# Altium project Jetson AGX Xavier Carrier Board.PrjPcb (part 3 of 8)

## Sheet M.2 E-KEY.SchDoc: M.2 E-Key Connector
size 431 x 279 mm; CheckedBy: Lance Bantoto; Engineer: Cindy Li; DocumentNumber: 18; Revision: 1; SheetNumber: 18; SheetTotal: 23
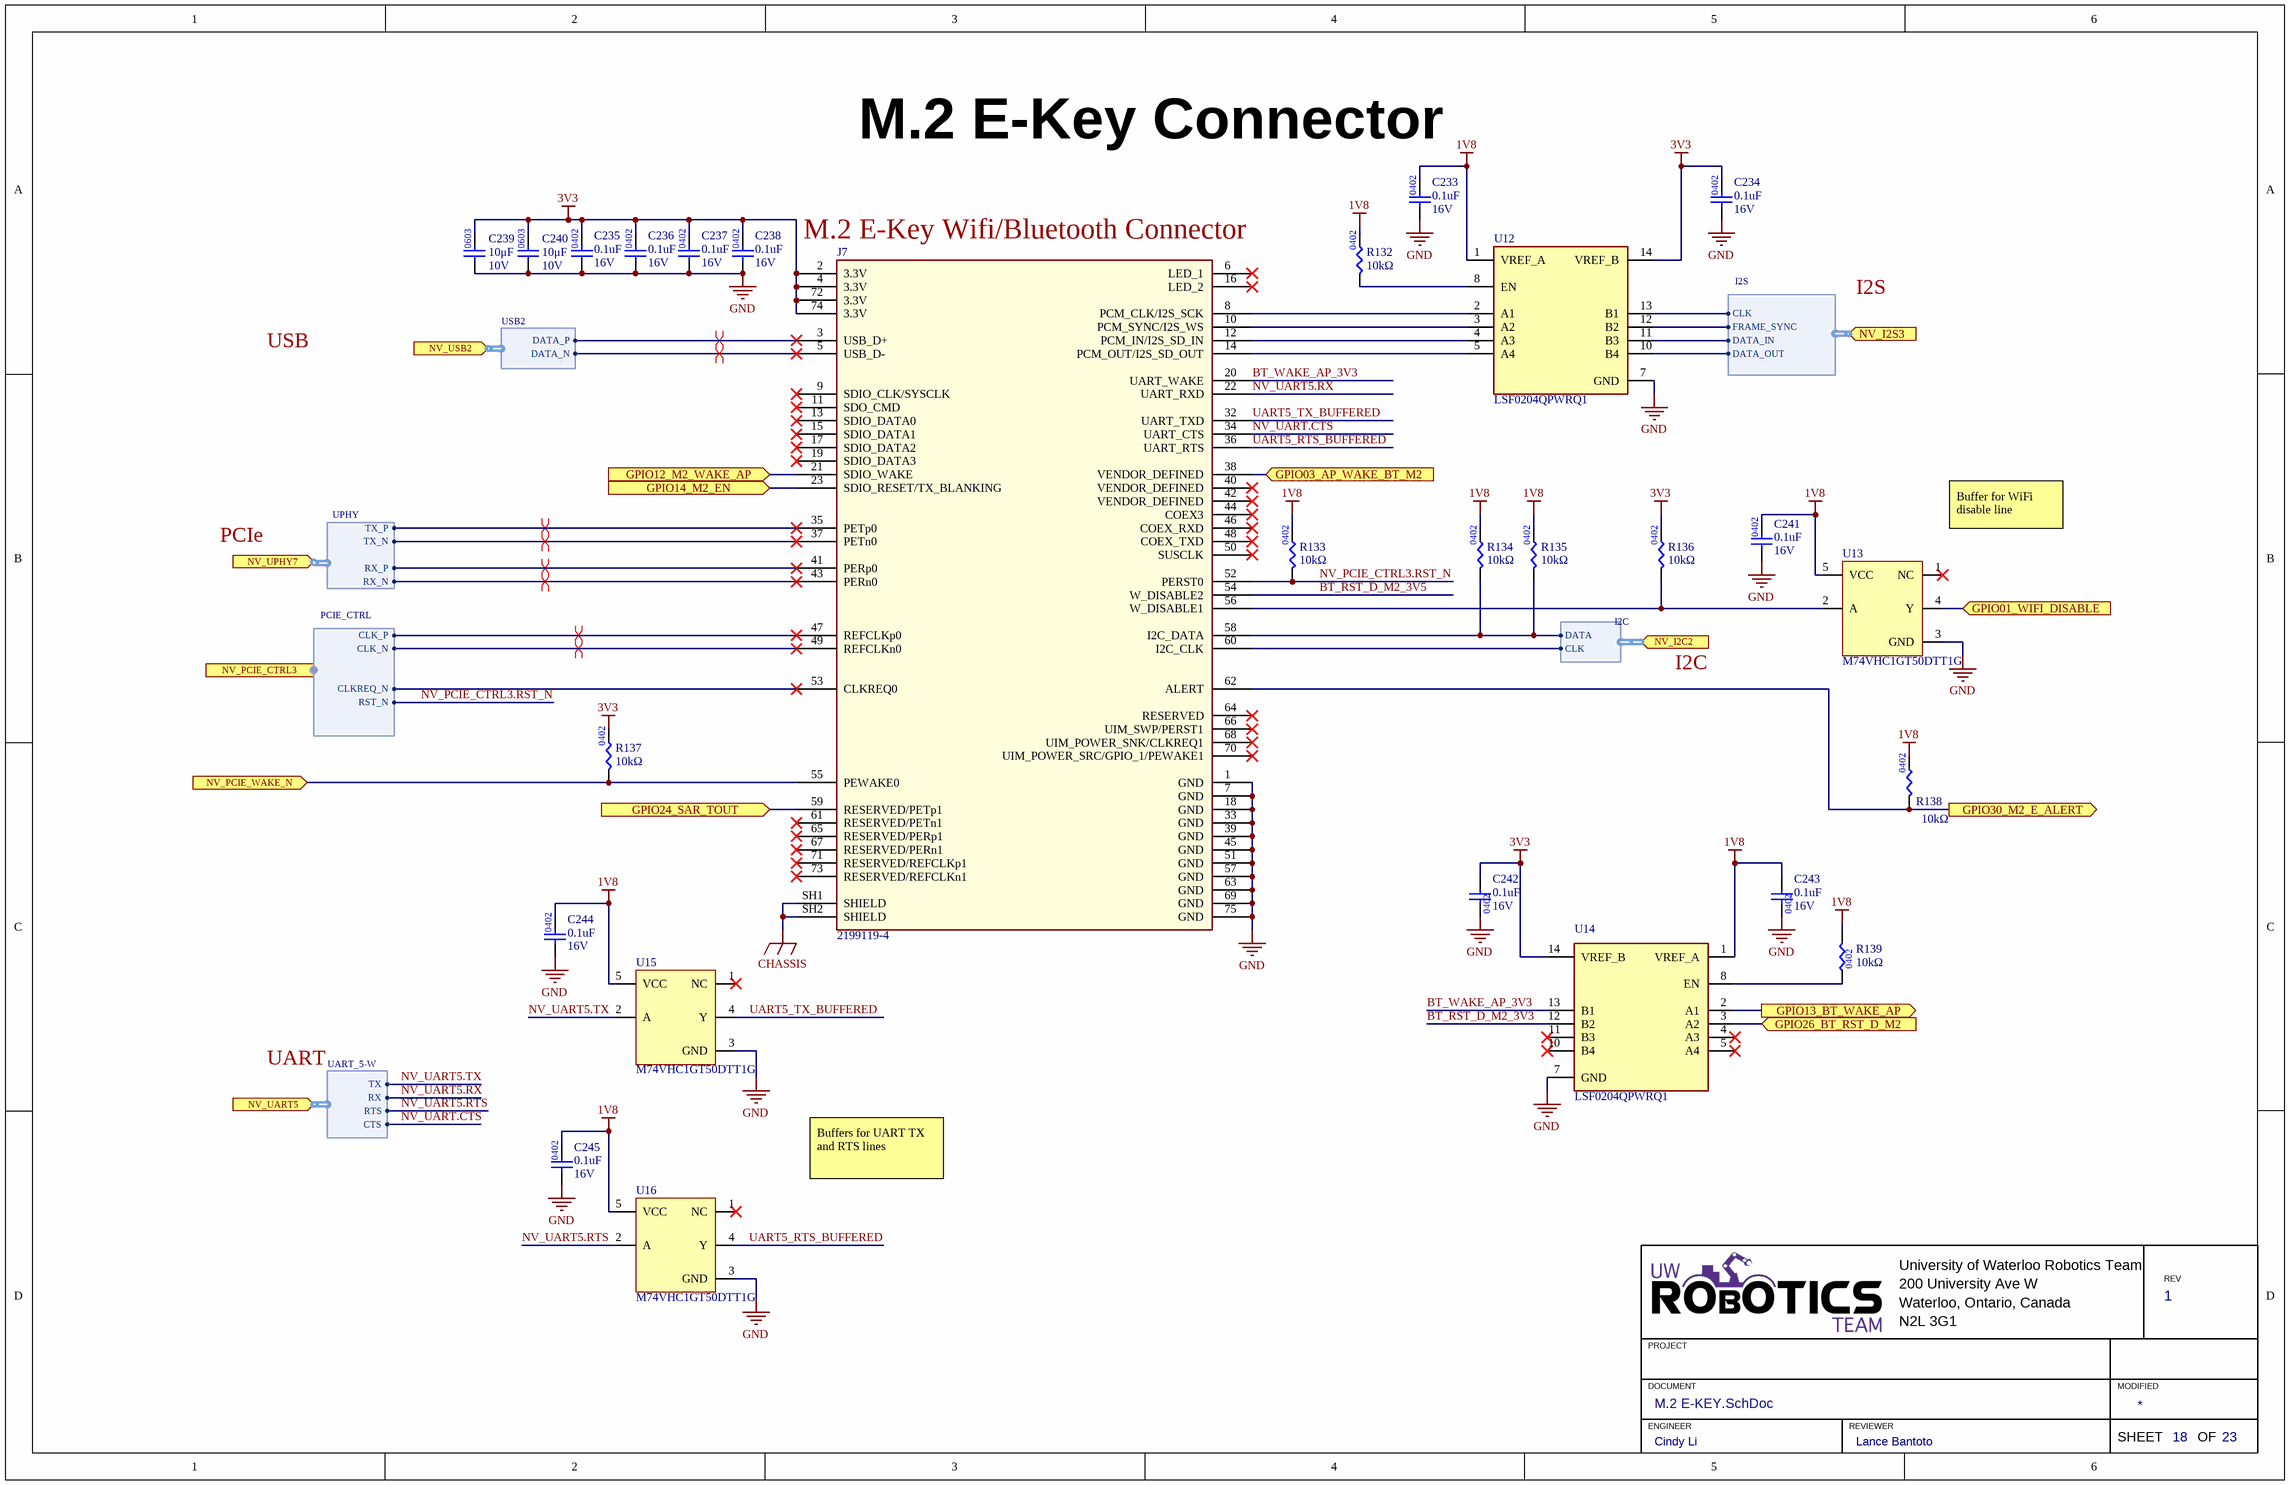
[diagram p6: M.2 E-KEY.SchDoc]

### Parts
C233  Capacitance: 0.1uF  Voltage Rating: 16V  [CAP0402]  (hidden comment: CAP_0.1uF_16V_X7R_0402)
C234  Capacitance: 0.1uF  Voltage Rating: 16V  [CAP0402]  (hidden comment: CAP_0.1uF_16V_X7R_0402)
C235  Capacitance: 0.1uF  Voltage Rating: 16V  [CAP0402]  (hidden comment: CAP_0.1uF_16V_X7R_0402)
C236  Capacitance: 0.1uF  Voltage Rating: 16V  [CAP0402]  (hidden comment: CAP_0.1uF_16V_X7R_0402)
C237  Capacitance: 0.1uF  Voltage Rating: 16V  [CAP0402]  (hidden comment: CAP_0.1uF_16V_X7R_0402)
C238  Capacitance: 0.1uF  Voltage Rating: 16V  [CAP0402]  (hidden comment: CAP_0.1uF_16V_X7R_0402)
C239  value 10μF  Voltage Rating: 10V  [CAP0603]  (hidden comment: CAP_10uF_10V_0603)
C240  value 10μF  Voltage Rating: 10V  [CAP0603]  (hidden comment: CAP_10uF_10V_0603)
C241  Capacitance: 0.1uF  Voltage Rating: 16V  [CAP0402]  (hidden comment: CAP_0.1uF_16V_X7R_0402)
C242  Capacitance: 0.1uF  Voltage Rating: 16V  [CAP0402]  (hidden comment: CAP_0.1uF_16V_X7R_0402)
C243  Capacitance: 0.1uF  Voltage Rating: 16V  [CAP0402]  (hidden comment: CAP_0.1uF_16V_X7R_0402)
C244  Capacitance: 0.1uF  Voltage Rating: 16V  [CAP0402]  (hidden comment: CAP_0.1uF_16V_X7R_0402)
C245  Capacitance: 0.1uF  Voltage Rating: 16V  [CAP0402]  (hidden comment: CAP_0.1uF_16V_X7R_0402)
J7  2199119-4  [TE_2199119-4]
R132  Resistance: 10kΩ  [RES0402]  (hidden comment: RES_10kΩ_0402_1%)
R133  Resistance: 10kΩ  [RES0402]  (hidden comment: RES_10kΩ_0402_1%)
R134  Resistance: 10kΩ  [RES0402]  (hidden comment: RES_10kΩ_0402_1%)
R135  Resistance: 10kΩ  [RES0402]  (hidden comment: RES_10kΩ_0402_1%)
R136  Resistance: 10kΩ  [RES0402]  (hidden comment: RES_10kΩ_0402_1%)
R137  Resistance: 10kΩ  [RES0402]  (hidden comment: RES_10kΩ_0402_1%)
R138  Resistance: 10kΩ  [RES0402]  (hidden comment: RES_10kΩ_0402_1%)
R139  Resistance: 10kΩ  [RES0402]  (hidden comment: RES_10kΩ_0402_1%)
U12  LSF0204QPWRQ1  [14-TSSOP]
U13  Manufacturer Part Number 1: M74VHC1GT50DTT1G  [SOT23-5]  (hidden comment: IC_BUFFER)
U14  LSF0204QPWRQ1  [14-TSSOP]
U15  Manufacturer Part Number 1: M74VHC1GT50DTT1G  [SOT23-5]  (hidden comment: IC_BUFFER)
U16  Manufacturer Part Number 1: M74VHC1GT50DTT1G  [SOT23-5]  (hidden comment: IC_BUFFER)

### Ports
GPIO01_WIFI_DISABLE (in), GPIO03_AP_WAKE_BT_M2 (in), GPIO12_M2_WAKE_AP (in), GPIO13_BT_WAKE_AP (out), GPIO14_M2_EN (in), GPIO24_SAR_TOUT (in), GPIO26_BT_RST_D_M2 (in), GPIO30_M2_E_ALERT (out), NV_I2C2 (in, harness I2C), NV_I2S3 (in, harness I2S), NV_PCIE_CTRL3 (in, harness PCIE_CTRL), NV_PCIE_WAKE_N (in), NV_UART5 (in, harness UART_5-W), NV_UPHY7 (in, harness UPHY), NV_USB2 (in, harness USB2)

### Harnesses
UPHY: TX_P, TX_N, RX_P, RX_N
PCIE_CTRL: CLK_P, CLK_N, RST_N, CLKREQ_N
I2C: CLK, DATA
I2S: CLK, FRAME_SYNC, DATA_IN, DATA_OUT
UART_5-W: TX, RX, RTS, CTS
USB2: DATA_P, DATA_N

### Nets
1V8: C233.2 C241.2 C243.2 C244.2 C245.2 R132.2 R133.2 R134.2 R135.2 R138.2 R139.2 U12.1(VREF_A) U13.5(VCC) U14.1(VREF_A) U15.5(VCC) U16.5(VCC)
3V3: C234.2 C235.2 C236.2 C237.2 C238.2 C239.2 C240.2 C242.2 J7.2(3.3V) J7.4(3.3V) J7.72(3.3V) J7.74(3.3V) R136.2 R137.2 U12.14(VREF_B) U14.14(VREF_B)
CHASSIS: J7.SH1(SHIELD) J7.SH2(SHIELD)
GND: C233.1 C234.1 C235.1 C236.1 C237.1 C238.1 C239.1 C240.1 C241.1 C242.1 C243.1 C244.1 C245.1 J7.1(GND) J7.7(GND) J7.18(GND) J7.33(GND) J7.39(GND) J7.45(GND) J7.51(GND) J7.57(GND) J7.63(GND) J7.69(GND) J7.75(GND) U12.7(GND) U13.3(GND) U14.7(GND) U15.3(GND) U16.3(GND)
BT_RST_D_M2_3V3: U14.12(B2)
BT_RST_D_M2_3V5: J7.54(W_DISABLE2)
BT_WAKE_AP_3V3: J7.20(UART_WAKE) U14.13(B1)
NV_I2C2.CLK: J7.60(I2C_CLK) ; port NV_I2C2.CLK
NV_I2C2.DATA: J7.58(I2C_DATA) R134.1 R135.1 ; port NV_I2C2.DATA
NV_PCIE_CTRL3.CLK_N: J7.49(REFCLKn0) ; port NV_PCIE_CTRL3.CLK_N
NV_PCIE_CTRL3.CLK_P: J7.47(REFCLKp0) ; port NV_PCIE_CTRL3.CLK_P
NV_PCIE_CTRL3.CLKREQ_N: J7.53(CLKREQ0) ; port NV_PCIE_CTRL3.CLKREQ_N
NV_PCIE_CTRL3.RST_N: J7.52(PERST0) R133.1 ; port NV_PCIE_CTRL3.RST_N
NV_PCIE_WAKE_N: J7.55(PEWAKE0) R137.1 ; port NV_PCIE_WAKE_N
NV_UART5.RTS: U16.2(A) ; port NV_UART5.RTS
NV_UART5.RX: J7.22(UART_RXD) ; port NV_UART5.RX
NV_UART5.TX: U15.2(A) ; port NV_UART5.TX
NV_UART.CTS: J7.34(UART_CTS) ; port NV_UART5.CTS
NV_UPHY7.RX_N: J7.43(PERn0) ; port NV_UPHY7.RX_N
NV_UPHY7.RX_P: J7.41(PERp0) ; port NV_UPHY7.RX_P
NV_UPHY7.TX_N: J7.37(PETn0) ; port NV_UPHY7.TX_N
NV_UPHY7.TX_P: J7.35(PETp0) ; port NV_UPHY7.TX_P
NV_USB2.DATA_N: J7.5(USB_D-) ; port NV_USB2.DATA_N
NV_USB2.DATA_P: J7.3(USB_D+) ; port NV_USB2.DATA_P
UART5_RTS_BUFFERED: J7.36(UART_RTS) U16.4(Y)
UART5_TX_BUFFERED: J7.32(UART_TXD) U15.4(Y)
NetJ7_8: J7.8(PCM_CLK/I2S_SCK) U12.2(A1)
NetJ7_10: J7.10(PCM_SYNC/I2S_WS) U12.3(A2)
NetJ7_12: J7.12(PCM_IN/I2S_SD_IN) U12.4(A3)
NetJ7_14: J7.14(PCM_OUT/I2S_SD_OUT) U12.5(A4)
NetJ7_21: J7.21(SDIO_WAKE) ; port GPIO12_M2_WAKE_AP
NetJ7_23: J7.23(SDIO_RESET/TX_BLANKING) ; port GPIO14_M2_EN
NetJ7_38: J7.38(VENDOR_DEFINED) ; port GPIO03_AP_WAKE_BT_M2
NetJ7_56: J7.56(W_DISABLE1) R136.1 U13.2(A)
NetJ7_59: J7.59(RESERVED/PETp1) ; port GPIO24_SAR_TOUT
NetJ7_62: J7.62(ALERT) R138.1 ; port GPIO30_M2_E_ALERT
NetR132_1: R132.1 U12.8(EN)
NetR139_1: R139.1 U14.8(EN)
NetU12_10: U12.10(B4) ; port NV_I2S3.DATA_OUT
NetU12_11: U12.11(B3) ; port NV_I2S3.DATA_IN
NetU12_12: U12.12(B2) ; port NV_I2S3.FRAME_SYNC
NetU12_13: U12.13(B1) ; port NV_I2S3.CLK
NetU13_4: U13.4(Y) ; port GPIO01_WIFI_DISABLE
NetU14_2: U14.2(A1) ; port GPIO13_BT_WAKE_AP
NetU14_3: U14.3(A2) ; port GPIO26_BT_RST_D_M2

Not connected (* = marked no-connect by the designer): J7 6(LED_1)* 9(SDIO_CLK/SYSCLK)* 11(SDO_CMD)* 13(SDIO_DATA0)* 15(SDIO_DATA1)* 16(LED_2)* 17(SDIO_DATA2)* 19(SDIO_DATA3)* 40(VENDOR_DEFINED)* 42(VENDOR_DEFINED)* 44(COEX3)* 46(COEX_RXD)* 48(COEX_TXD)* 50(SUSCLK)* 61(RESERVED/PETn1)* 64(RESERVED)* 65(RESERVED/PERp1)* 66(UIM_SWP/PERST1)* 67(RESERVED/PERn1)* 68(UIM_POWER_SNK/CLKREQ1)* 70(UIM_POWER_SRC/GPIO_1/PEWAKE1)* 71(RESERVED/REFCLKp1)* 73(RESERVED/REFCLKn1)*; U13 1(NC)*; U14 4(A3)* 5(A4)* 10(B4)* 11(B3)*; U15 1(NC)*; U16 1(NC)*

### Layout directives
differential pair: NV_PCIE_CTRL3.CLK_N, NV_PCIE_CTRL3.CLK_P, NV_UPHY7.RX_N, NV_UPHY7.RX_P, NV_UPHY7.TX_N, NV_UPHY7.TX_P, NV_USB2.DATA_N, NV_USB2.DATA_P

### Notes on the sheet
- (near J7) M.2 E-Key Wifi/Bluetooth Connector
- I2S
- USB
- PCIe
- Buffer for WiFi disable line
- I2C
- UART
- Buffers for UART TX and RTS lines
- University of Waterloo Robotics Team
- 200 University Ave W
- REV
- PROJECT
- Waterloo, Ontario, Canada
- N2L 3G1
- DOCUMENT
- ENGINEER
- REVIEWER
- MODIFIED
- SHEET
- OF
- (in symbol CAP_10uF_10V_0603) 0603

### Library data of the parts
C233-C238 C241-C245 = CAP_0.1uF_16V_X7R_0402: CAP CER 0.1UF 16V X7R 0402; Supplier 1: Digi-Key; Mounting Type: Surface Mount; Package: 0402
C239 C240 = CAP_10uF_10V_0603: CAP CER 10UF 10V X5R 0603; Manufacturer 1: Yageo; Manufacturer Part Number 1: CC0603MRX5R6BB106; Supplier Part Number 1: 311-1817-1-ND; Supplier 1: Digi-Key; Dielectric: X5R
J7 = 2199119-4: CONN M.2 FEMALE 67POS 0.020 GOLD; Manufacturer 1: TE Connectivity; Number of Positions: 67; Pitch: 0.020" (0.50mm); Supplier 1: Digi-Key; Supplier Part Number 1: A115900CT-ND; Gender: Female; Manufacturer Part Number 1: 2199119-4
R132 R133 R137-R139 = RES_10kΩ_0402_1%: RES 10K OHM 1% 1/16W 0402; Manufacturer Part Number 1: RC1005F103CS; Manufacturer 1: Samsung Electro-Mechanics; Supplier 1: Digi-Key; Supplier Part Number 1: 1276-3431-1-ND; Tolerance: 1%; Package: 0402
R134-R136 = RES_10kΩ_0402_1%: RES 10K OHM 1% 1/16W 0402; Manufacturer 1: Samsung Electro-Mechanics; Manufacturer Part Number 1: RC1005F103CS; Supplier Part Number 1: 1276-3431-1-ND; Supplier 1: Digi-Key; Tolerance: 1%; Package: 0402
U12 U14 = LSF0204QPWRQ1: 4-BITS MULTI-VOLTAGE LEVEL TRANS; Manufacturer 1: Texas Instruments; Channel Type: Bidirectional; Channels per Circuit: 4; Output Type: Open Drain, Push Pull; Data Rate: 100MBd; Voltage - VCCA: 0.8V - 4.5V; Voltage - VCCB: 1.8V - 5.5V; Manufacturer Part Number 1: LSF0204QPWRQ1; Supplier 1: Digi-Key; Supplier Part Number 1: 296-51425-1-ND; Package: 14-TSSOP
U13 U15 U16 = IC_BUFFER: IC BUFFER NON-INVERT 5.5V 5TSOP; Manufacturer 1: onsemi; Package/Footprint: TSOP-5; Supplier 1: Digi-Key; Mounting Type: SMD; Supplier Part Number 1: M74VHC1GT50DTT1GOSCT-ND

## Sheet M.2 M-KEY.SchDoc: M.2 M-KEY Connector
size 431 x 279 mm; CheckedBy: Lance Bantoto; Engineer: Chealsie Bains; DocumentNumber: 19; Revision: 1; SheetNumber: 19; SheetTotal: 23
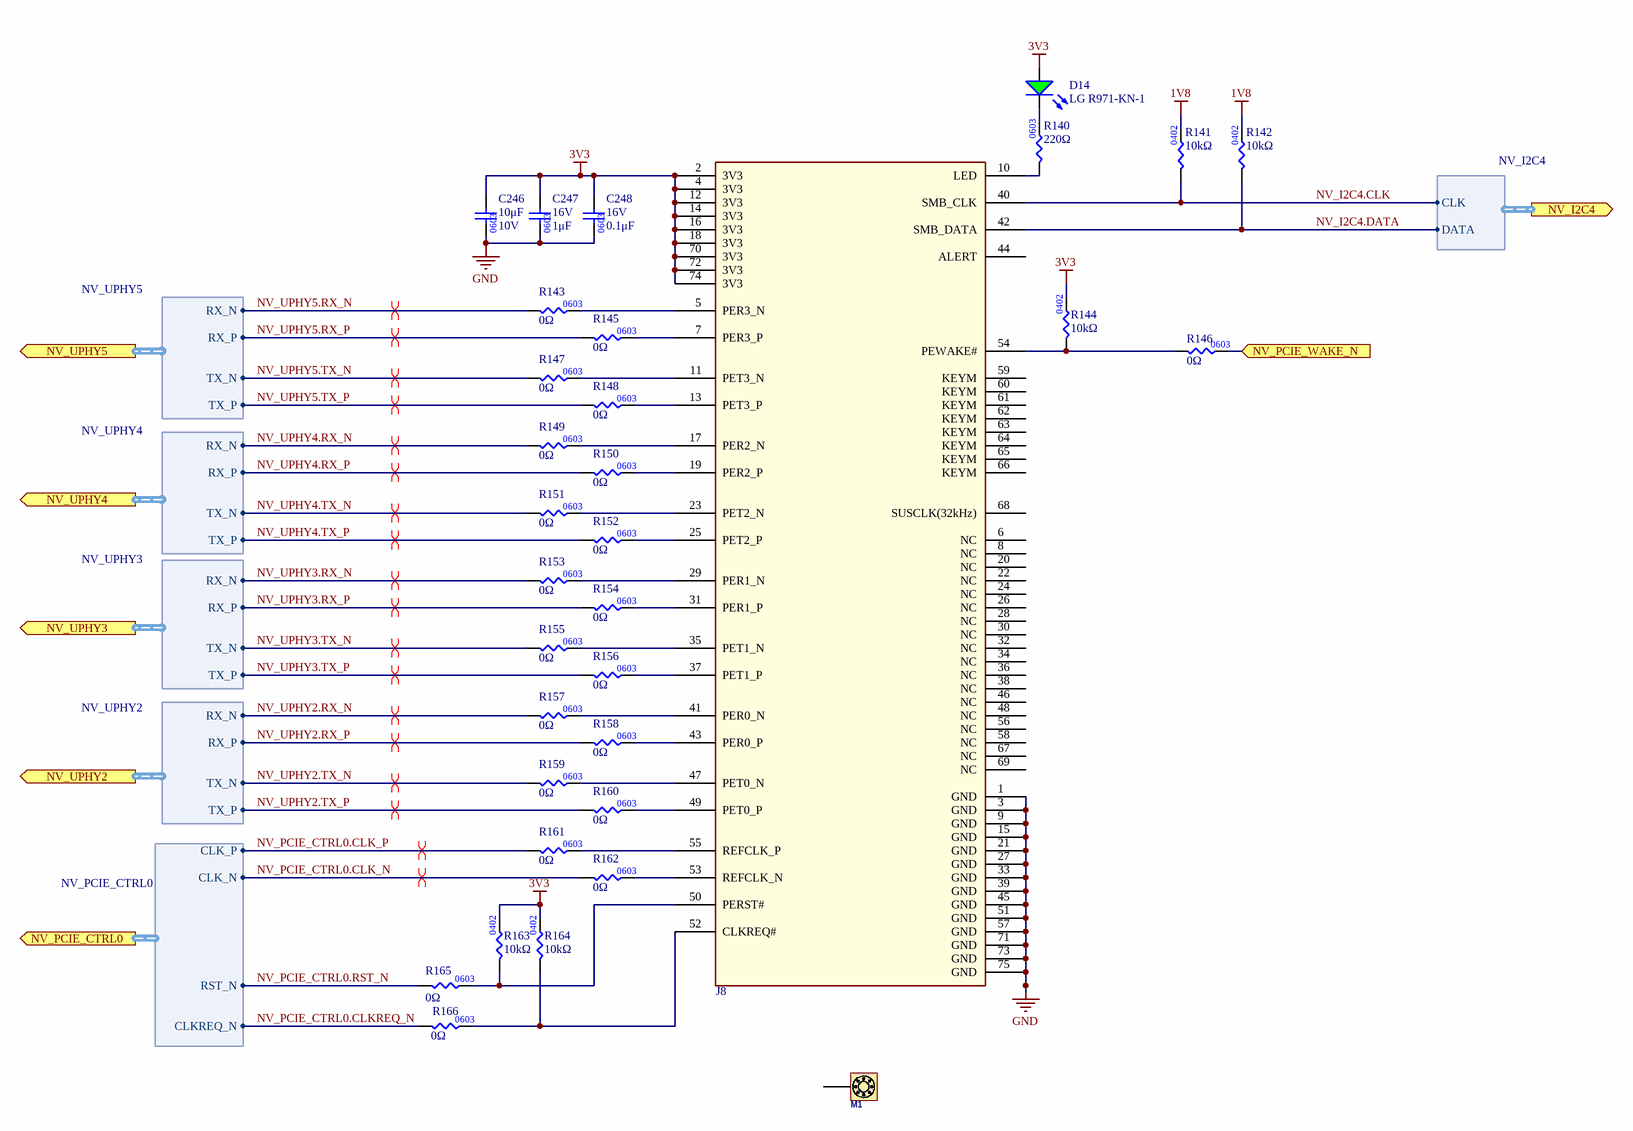
[diagram p7: M.2 M-KEY.SchDoc]

### Parts
C246  value 10μF  Voltage Rating: 10V  [CAP0603]  (hidden comment: CAP_10uF_10V_0603)
C247  value 1μF  Voltage Rating: 16V  [CAP0603]  (hidden comment: CAP_1uF_16V_0603)
C248  value 0.1μF  Voltage Rating: 16V  [CAP0603]  (hidden comment: CAP_0.1uF_16V_0603)
D14  Manufacturer Part Number 1: LG R971-KN-1  [LED_0805_GREEN]  (hidden comment: LED_GREEN)
J8  CONN M.2 FEMALE 67POS 0.020 GOLD  [TE_2199119-4]  (value not drawn)
M1  M3_SMT_STANDOFF_4-0MM  [M3_SMT_4-0MM]  (value not drawn)
R140  value 220Ω  [RES0603]  (hidden comment: RES_220Ω_0603)
R141  value 10kΩ  [RES0402]  (hidden comment: RES_10kΩ_0402_1%)
R142  value 10kΩ  [RES0402]  (hidden comment: RES_10kΩ_0402_1%)
R143  value 0Ω  [RES0603]  (hidden comment: RES_0Ω_0603)
R144  value 10kΩ  [RES0402]  (hidden comment: RES_10kΩ_0402_1%)
R145  value 0Ω  [RES0603]  (hidden comment: RES_0Ω_0603)
R146  value 0Ω  [RES0603]  (hidden comment: RES_0Ω_0603)
R147  value 0Ω  [RES0603]  (hidden comment: RES_0Ω_0603)
R148  value 0Ω  [RES0603]  (hidden comment: RES_0Ω_0603)
R149  value 0Ω  [RES0603]  (hidden comment: RES_0Ω_0603)
R150  value 0Ω  [RES0603]  (hidden comment: RES_0Ω_0603)
R151  value 0Ω  [RES0603]  (hidden comment: RES_0Ω_0603)
R152  value 0Ω  [RES0603]  (hidden comment: RES_0Ω_0603)
R153  value 0Ω  [RES0603]  (hidden comment: RES_0Ω_0603)
R154  value 0Ω  [RES0603]  (hidden comment: RES_0Ω_0603)
R155  value 0Ω  [RES0603]  (hidden comment: RES_0Ω_0603)
R156  value 0Ω  [RES0603]  (hidden comment: RES_0Ω_0603)
R157  value 0Ω  [RES0603]  (hidden comment: RES_0Ω_0603)
R158  value 0Ω  [RES0603]  (hidden comment: RES_0Ω_0603)
R159  value 0Ω  [RES0603]  (hidden comment: RES_0Ω_0603)
R160  value 0Ω  [RES0603]  (hidden comment: RES_0Ω_0603)
R161  value 0Ω  [RES0603]  (hidden comment: RES_0Ω_0603)
R162  value 0Ω  [RES0603]  (hidden comment: RES_0Ω_0603)
R163  value 10kΩ  [RES0402]  (hidden comment: RES_10kΩ_0402_1%)
R164  value 10kΩ  [RES0402]  (hidden comment: RES_10kΩ_0402_1%)
R165  value 0Ω  [RES0603]  (hidden comment: RES_0Ω_0603)
R166  value 0Ω  [RES0603]  (hidden comment: RES_0Ω_0603)

### Ports
NV_I2C4 (out, harness NV_I2C4), NV_PCIE_CTRL0 (out, harness NV_PCIE_CTRL0), NV_PCIE_WAKE_N (in), NV_UPHY2 (out, harness NV_UPHY2), NV_UPHY3 (out, harness NV_UPHY3), NV_UPHY4 (out, harness NV_UPHY4), NV_UPHY5 (out, harness NV_UPHY5)

### Harnesses
NV_UPHY5: RX_N, RX_P, TX_N, TX_P
NV_UPHY4: RX_N, RX_P, TX_N, TX_P
NV_UPHY3: RX_N, RX_P, TX_N, TX_P
NV_UPHY2: RX_N, RX_P, TX_N, TX_P
NV_PCIE_CTRL0: CLK_P, CLK_N, RST_N, CLKREQ_N
NV_I2C4: CLK, DATA

### Nets
1V8: R141.2 R142.2
3V3: C246.2 C247.2 C248.2 D14.1(A) J8.2(3V3) J8.4(3V3) J8.12(3V3) J8.14(3V3) J8.16(3V3) J8.18(3V3) J8.70(3V3) J8.72(3V3) J8.74(3V3) R144.2 R163.2 R164.2
GND: C246.1 C247.1 C248.1 J8.1(GND) J8.3(GND) J8.9(GND) J8.15(GND) J8.21(GND) J8.27(GND) J8.33(GND) J8.39(GND) J8.45(GND) J8.51(GND) J8.57(GND) J8.71(GND) J8.73(GND) J8.75(GND)
NV_I2C4.CLK: J8.40(SMB_CLK) R141.1 ; port NV_I2C4.CLK
NV_I2C4.DATA: J8.42(SMB_DATA) R142.1 ; port NV_I2C4.DATA
NV_PCIE_CTRL0.CLK_N: R162.1 ; port NV_PCIE_CTRL0.CLK_N
NV_PCIE_CTRL0.CLK_P: R161.1 ; port NV_PCIE_CTRL0.CLK_P
NV_PCIE_CTRL0.CLKREQ_N: R166.1 ; port NV_PCIE_CTRL0.CLKREQ_N
NV_PCIE_CTRL0.RST_N: R165.1 ; port NV_PCIE_CTRL0.RST_N
NV_PCIE_WAKE_N: R146.2 ; port NV_PCIE_WAKE_N
NV_UPHY2.RX_N: R157.1 ; port NV_UPHY2.RX_N
NV_UPHY2.RX_P: R158.1 ; port NV_UPHY2.RX_P
NV_UPHY2.TX_N: R159.1 ; port NV_UPHY2.TX_N
NV_UPHY2.TX_P: R160.1 ; port NV_UPHY2.TX_P
NV_UPHY3.RX_N: R153.1 ; port NV_UPHY3.RX_N
NV_UPHY3.RX_P: R154.1 ; port NV_UPHY3.RX_P
NV_UPHY3.TX_N: R155.1 ; port NV_UPHY3.TX_N
NV_UPHY3.TX_P: R156.1 ; port NV_UPHY3.TX_P
NV_UPHY4.RX_N: R149.1 ; port NV_UPHY4.RX_N
NV_UPHY4.RX_P: R150.1 ; port NV_UPHY4.RX_P
NV_UPHY4.TX_N: R151.1 ; port NV_UPHY4.TX_N
NV_UPHY4.TX_P: R152.1 ; port NV_UPHY4.TX_P
NV_UPHY5.RX_N: R143.1 ; port NV_UPHY5.RX_N
NV_UPHY5.RX_P: R145.1 ; port NV_UPHY5.RX_P
NV_UPHY5.TX_N: R147.1 ; port NV_UPHY5.TX_N
NV_UPHY5.TX_P: R148.1 ; port NV_UPHY5.TX_P
NetD14_2: D14.2(K) R140.2
NetJ8_5: J8.5(PER3_N) R143.2
NetJ8_7: J8.7(PER3_P) R145.2
NetJ8_10: J8.10(LED) R140.1
NetJ8_11: J8.11(PET3_N) R147.2
NetJ8_13: J8.13(PET3_P) R148.2
NetJ8_17: J8.17(PER2_N) R149.2
NetJ8_19: J8.19(PER2_P) R150.2
NetJ8_23: J8.23(PET2_N) R151.2
NetJ8_25: J8.25(PET2_P) R152.2
NetJ8_29: J8.29(PER1_N) R153.2
NetJ8_31: J8.31(PER1_P) R154.2
NetJ8_35: J8.35(PET1_N) R155.2
NetJ8_37: J8.37(PET1_P) R156.2
NetJ8_41: J8.41(PER0_N) R157.2
NetJ8_43: J8.43(PER0_P) R158.2
NetJ8_47: J8.47(PET0_N) R159.2
NetJ8_49: J8.49(PET0_P) R160.2
NetJ8_50: J8.50(PERST#) R163.1 R165.2
NetJ8_52: J8.52(CLKREQ#) R164.1 R166.2
NetJ8_53: J8.53(REFCLK_N) R162.2
NetJ8_54: J8.54(PEWAKE#) R144.1 R146.1
NetJ8_55: J8.55(REFCLK_P) R161.2

Not connected (* = marked no-connect by the designer): J8 6(NC) 8(NC) 20(NC) 22(NC) 24(NC) 26(NC) 28(NC) 30(NC) 32(NC) 34(NC) 36(NC) 38(NC) 44(ALERT) 46(NC) 48(NC) 56(NC) 58(NC) 59(KEYM) 60(KEYM) 61(KEYM) 62(KEYM) 63(KEYM) 64(KEYM) 65(KEYM) 66(KEYM) 67(NC) 68(SUSCLK(32kHz)) 69(NC); M1 0

### Layout directives
differential pair: NV_PCIE_CTRL0.CLK_N, NV_PCIE_CTRL0.CLK_P, NV_UPHY2.RX_N, NV_UPHY2.RX_P, NV_UPHY2.TX_N, NV_UPHY2.TX_P, NV_UPHY3.RX_N, NV_UPHY3.RX_P, NV_UPHY3.TX_N, NV_UPHY3.TX_P, NV_UPHY4.RX_N, NV_UPHY4.RX_P, NV_UPHY4.TX_N, NV_UPHY4.TX_P, NV_UPHY5.RX_N, NV_UPHY5.RX_P, NV_UPHY5.TX_N, NV_UPHY5.TX_P

### Notes on the sheet
- University of Waterloo Robotics Team
- 200 University Ave W
- REV
- PROJECT
- Waterloo, Ontario, Canada
- N2L 3G1
- DOCUMENT
- ENGINEER
- REVIEWER
- MODIFIED
- SHEET
- OF
- (in symbol CAP_10uF_10V_0603) 0603

### Library data of the parts
C246 = CAP_10uF_10V_0603: CAP CER 10UF 10V X5R 0603; Manufacturer Part Number 1: CC0603MRX5R6BB106; Manufacturer 1: Yageo; Supplier Part Number 1: 311-1817-1-ND; Supplier 1: Digi-Key; Dielectric: X5R
C247 = CAP_1uF_16V_0603: CAP CER 1UF 16V Y5V 0603; Manufacturer 1: Yageo; Manufacturer Part Number 1: CC0603ZRY5V7BB105; Package/Footprint: 0603; Supplier Part Number 1: 311-1372-1-ND; Supplier 1: Digi-Key; Mounting Type: SMD; Dielectric: Y5V
C248 = CAP_0.1uF_16V_0603: CAP CER 0.1UF 16V X7R 0603; Manufacturer Part Number 1: CC0603KRX7R7BB104; Manufacturer 1: Yageo; Package/Footprint: 0603; Supplier Part Number 1: 311-1088-1-ND; Supplier 1: Digi-Key; Dielectric: X7R
D14 = LED_GREEN: LED GREEN DIFFUSED 0805 SMD; Manufacturer 1: OSRAM; Forward Voltage Drop: 2.2V; Package/Footprint: 0805; Supplier Part Number 1: 475-1410-1-ND; Supplier 1: Digi-Key; Mounting Type: SMD
J8 = CONN M.2 FEMALE 67POS 0.020 GOLD: Card Edge Connector, 67 Contact(s), 2 Row(s), Female, Right Angle, 0.019 inch Pitch, Locking, Black Insulator, Socket; Manufacturer: TE Connectivity; Manufacturer Part Number: 1-2199119-5; Supplier 1: Digi-Key; Supplier Part Number 1: A115902CT-ND; RoHS: Yes; Category: Card Edge Connectors; Stock 1: 13599; Pricing 1: 1=1.28000, 10=1.12400, 25=1.05760, 50=1.01340, 100=0.96940, 250=0.88128, 500=0.79314 (USD); Connector Type: CARD EDGE CONNECTOR; REACH SVHC: Yes; RoHS Compliant: Yes; ComponentLink1URL: https://datasheet.ciiva.com:443/pdfs/VipMasterIC/IC/TYEL/TYEL-S-A0008646546/TYEL-S-A0008667243-1.pdf?src-supplier=IHS+Markit; ComponentLink1Description: https://datasheet.ciiva.com:443/pdfs/VipMasterIC/IC/TYEL/TYEL-S-A0008646546/TYEL-S-A0008667243-1.pdf?src-supplier=IHS+Markit; ComponentLink2URL: https://datasheet.ciiva.com/18495/eng-cd-2199119-c-c-2199119-c-18495963.pdf?src-supplier=Digi-Key; ComponentLink2Description: https://datasheet.ciiva.com/18495/eng-cd-2199119-c-c-2199119-c-18495963.pdf?src-supplier=Digi-Key; ComponentLink3URL: https://datasheet.ciiva.com/18495/eng-cd-2199119-c-c-2199119-c-18495964.pdf?src-supplier=Digi-Key; ComponentLink3Description: https://datasheet.ciiva.com/18495/eng-cd-2199119-c-c-2199119-c-18495964.pdf?src-supplier=Digi-Key; ComponentLink4URL: https://datasheet.ciiva.com/18495/eng-cd-2199119-c-c-2199119-c-18495965.pdf?src-supplier=Digi-Key; ComponentLink4Description: https://datasheet.ciiva.com/18495/eng-cd-2199119-c-c-2199119-c-18495965.pdf?src-supplier=Digi-Key
M1 = M3_SMT_STANDOFF_4-0MM: ROUND STANDOFF M3X0.5 STEEL 4MM; Manufacturer 1: Würth Elektronik; Manufacturer Part Number 1: 9774040360R; Supplier 1: Digi-Key; Supplier Part Number 1: 732-5271-1-ND
R140 = RES_220Ω_0603_5%: RES 220 OHM 5% 1/10W 0603; Manufacturer 1: Yageo; Manufacturer Part Number 1: AC0603JR-07220RL; Package/Footprint: 0603; Supplier Part Number 1: YAG3652CT-ND; Supplier 1: Digi-Key
R141 R142 = RES_10kΩ_0402_1%: RES SMD 10K OHM 1% 1/16W 0402; Manufacturer 1: Vishay Dale; Manufacturer Part Number 1: CRCW040210K0FKTD; Package/Footprint: 0402; Power: 0.063W, 1/16W; Supplier Part Number 1: 541-2955-1-ND; Supplier 1: Digi-Key; Mounting Type: SMD; Tolerance: 1%
R143 R145 R147-R162 = RES_0Ω_0603: RES 0 OHM JUMPER 1/10W 0603; Manufacturer 1: Yageo; Manufacturer Part Number 1: RC0603JR-070RL; Supplier Part Number 1: 311-0.0GRCT-ND; Supplier 1: Digi-Key; Mounting Type: SMD; Package: 0603
R144 R163 R164 = RES_10kΩ_0402_1%: RES SMD 10K OHM 1% 1/16W 0402; Manufacturer Part Number 1: CRCW040210K0FKTD; Manufacturer 1: Vishay Dale; Power: 0.063W, 1/16W; Package/Footprint: 0402; Supplier 1: Digi-Key; Supplier Part Number 1: 541-2955-1-ND; Mounting Type: SMD; Tolerance: 1%
R146 R165 R166 = RES_0Ω_0603: RES 0 OHM JUMPER 1/10W 0603; Manufacturer 1: Yageo; Manufacturer Part Number 1: RC0603JR-070RL; Package/Footprint: 0603; Supplier Part Number 1: 311-0.0GRCT-ND; Supplier 1: Digi-Key; Mounting Type: SMD

## Sheet GPIO AND SERIAL.SchDoc: GPIO and Serial
size 431 x 558 mm; CheckedBy: Lance Bantoto; Engineer: Cindy Li; DocumentNumber: 20; Revision: 1; SheetNumber: 20; SheetTotal: 23
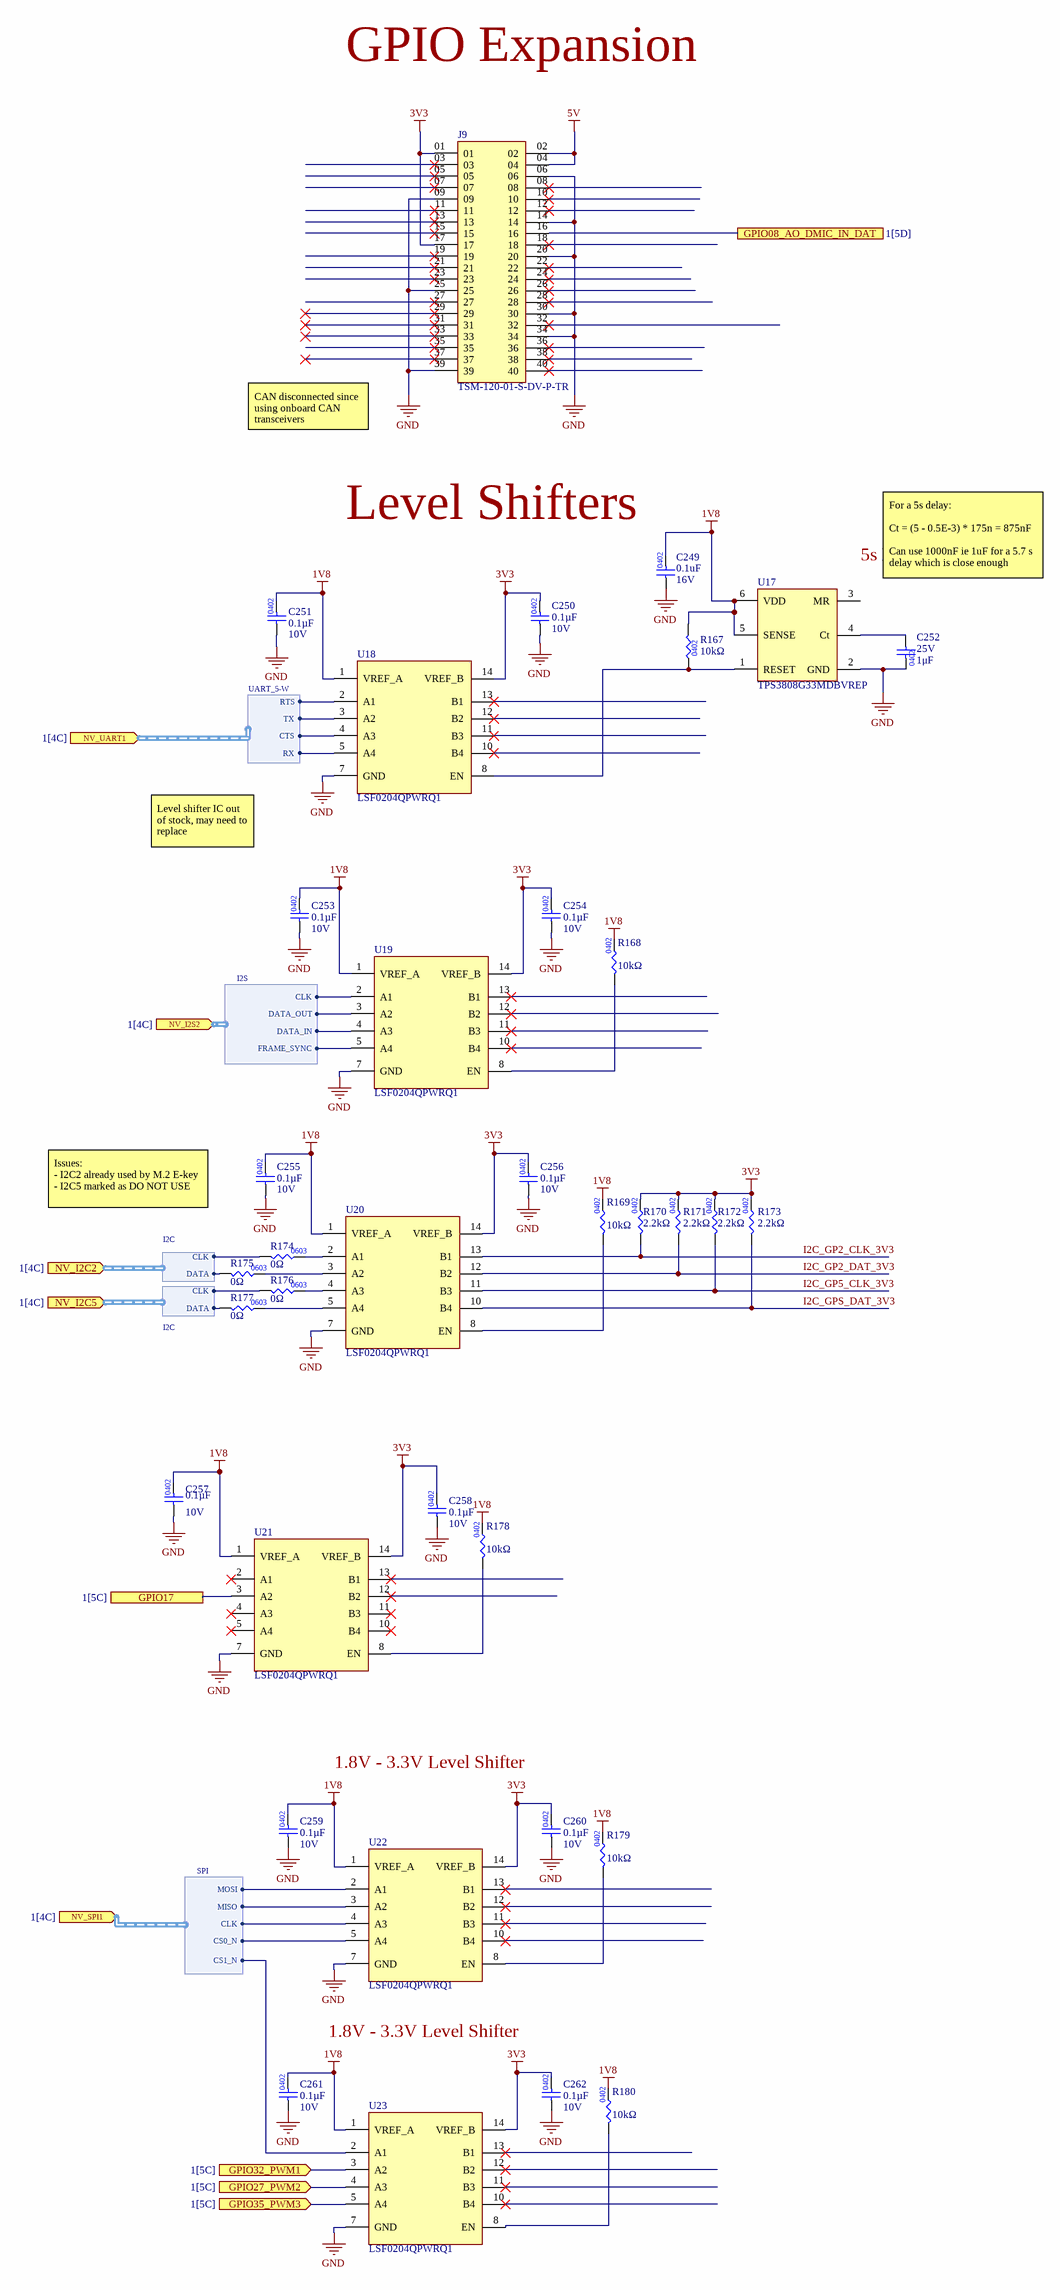
[diagram p8: GPIO AND SERIAL.SchDoc]

### Parts
C249  Capacitance: 0.1uF  Voltage Rating: 16V  [CAP0402]  (hidden comment: CAP_0.1uF_16V_X7R_0402)
C250  value 0.1µF  Voltage Rating: 10V  [CAP0402]  (hidden comment: CAP_0.1uF_10V_0402)
C251  value 0.1µF  Voltage Rating: 10V  [CAP0402]  (hidden comment: CAP_0.1uF_10V_0402)
C252  value 1μF  Voltage: 25V  [CAP0402]  (hidden comment: CAP_1uF_25V_0402)
C253  value 0.1µF  Voltage Rating: 10V  [CAP0402]  (hidden comment: CAP_0.1uF_10V_0402)
C254  value 0.1µF  Voltage Rating: 10V  [CAP0402]  (hidden comment: CAP_0.1uF_10V_0402)
C255  value 0.1µF  Voltage Rating: 10V  [CAP0402]  (hidden comment: CAP_0.1uF_10V_0402)
C256  value 0.1µF  Voltage Rating: 10V  [CAP0402]  (hidden comment: CAP_0.1uF_10V_0402)
C257  value 0.1µF  Voltage Rating: 10V  [CAP0402]  (hidden comment: CAP_0.1uF_10V_0402)
C258  value 0.1µF  Voltage Rating: 10V  [CAP0402]  (hidden comment: CAP_0.1uF_10V_0402)
C259  value 0.1µF  Voltage Rating: 10V  [CAP0402]  (hidden comment: CAP_0.1uF_10V_0402)
C260  value 0.1µF  Voltage Rating: 10V  [CAP0402]  (hidden comment: CAP_0.1uF_10V_0402)
C261  value 0.1µF  Voltage Rating: 10V  [CAP0402]  (hidden comment: CAP_0.1uF_10V_0402)
C262  value 0.1µF  Voltage Rating: 10V  [CAP0402]  (hidden comment: CAP_0.1uF_10V_0402)
J9  TSM-120-01-S-DV-P-TR  [SAMTEC_TSM-120-01-S-DV-P-TR]
R167  Resistance: 10kΩ  [RES0402]  (hidden comment: RES_10kΩ_0402_1%)
R168  value 10kΩ  [RES0402]  (hidden comment: RES_10kΩ_0402_1%)
R169  value 10kΩ  [RES0402]  (hidden comment: RES_10kΩ_0402_1%)
R170  value 2.2kΩ  [RES0402]  (hidden comment: RES_2.2kΩ_0402_5%)
R171  value 2.2kΩ  [RES0402]  (hidden comment: RES_2.2kΩ_0402_5%)
R172  value 2.2kΩ  [RES0402]  (hidden comment: RES_2.2kΩ_0402_5%)
R173  value 2.2kΩ  [RES0402]  (hidden comment: RES_2.2kΩ_0402_5%)
R174  value 0Ω  [RES0603]  (hidden comment: RES_0Ω_0603)
R175  value 0Ω  [RES0603]  (hidden comment: RES_0Ω_0603)
R176  value 0Ω  [RES0603]  (hidden comment: RES_0Ω_0603)
R177  value 0Ω  [RES0603]  (hidden comment: RES_0Ω_0603)
R178  value 10kΩ  [RES0402]  (hidden comment: RES_10kΩ_0402_1%)
R179  value 10kΩ  [RES0402]  (hidden comment: RES_10kΩ_0402_1%)
R180  value 10kΩ  [RES0402]  (hidden comment: RES_10kΩ_0402_1%)
U17  TPS3808G33MDBVREP  [TPS3808G33MDBVREP]
U18  LSF0204QPWRQ1  [14-TSSOP]
U19  LSF0204QPWRQ1  [14-TSSOP]
U20  LSF0204QPWRQ1  [14-TSSOP]
U21  LSF0204QPWRQ1  [14-TSSOP]
U22  LSF0204QPWRQ1  [14-TSSOP]
U23  LSF0204QPWRQ1  [14-TSSOP]

### Ports
GPIO08_AO_DMIC_IN_DAT (see 1[5D]), GPIO17 (see 1[5C]), GPIO27_PWM2 (in, see 1[5C]), GPIO32_PWM1 (in, see 1[5C]), GPIO35_PWM3 (in, see 1[5C]), NV_I2C2 (in, harness I2C, see 1[4C]), NV_I2C5 (in, harness I2C, see 1[4C]), NV_I2S2 (in, harness I2S, see 1[4C]), NV_SPI1 (in, harness SPI, see 1[4C]), NV_UART1 (in, harness UART_5-W, see 1[4C])

### Harnesses
UART_5-W: TX, RX, RTS, CTS
SPI: CLK, MOSI, MISO, CS0_N, CS1_N
I2S: CLK, DATA_IN, DATA_OUT, FRAME_SYNC
I2C: CLK, DATA

### Nets
1V8: C249.2 C251.2 C253.2 C255.2 C257.2 C259.2 C261.2 R167.2 R168.2 R169.2 R178.2 R179.2 R180.2 U17.5(SENSE) U17.6(VDD) U18.1(VREF_A) U19.1(VREF_A) U20.1(VREF_A) U21.1(VREF_A) U22.1(VREF_A) U23.1(VREF_A)
3V3: C250.2 C254.2 C256.2 C258.2 C260.2 C262.2 J9.01 J9.17 R170.2 R171.2 R172.2 R173.2 U18.14(VREF_B) U19.14(VREF_B) U20.14(VREF_B) U21.14(VREF_B) U22.14(VREF_B) U23.14(VREF_B)
5V: J9.02 J9.04
GND: C249.1 C250.1 C251.1 C252.1 C253.1 C254.1 C255.1 C256.1 C257.1 C258.1 C259.1 C260.1 C261.1 C262.1 J9.06 J9.09 J9.14 J9.20 J9.25 J9.30 J9.34 J9.39 U17.2(GND) U18.7(GND) U19.7(GND) U20.7(GND) U21.7(GND) U22.7(GND) U23.7(GND)
I2C_GP2_CLK_3V3: R170.1 U20.13(B1)
I2C_GP2_DAT_3V3: R171.1 U20.12(B2)
I2C_GP5_CLK_3V3: R172.1 U20.11(B3)
I2C_GPS_DAT_3V3: R173.1 U20.10(B4)
NV_I2C2.CLK: R174.1 ; port NV_I2C2.CLK
NV_I2C2.DATA: R175.1 ; port NV_I2C2.DATA
NV_I2S2.CLK: U19.2(A1) ; port NV_I2S2.CLK
NV_I2S2.DATA_IN: U19.4(A3) ; port NV_I2S2.DATA_IN
NV_I2S2.DATA_OUT: U19.3(A2) ; port NV_I2S2.DATA_OUT
NV_I2S2.FRAME_SYNC: U19.5(A4) ; port NV_I2S2.FRAME_SYNC
NV_SPI1.CLK: U22.4(A3) ; port NV_SPI1.CLK
NV_SPI1.CS0_N: U22.5(A4) ; port NV_SPI1.CS0_N
NV_SPI1.CS1_N: U23.2(A1) ; port NV_SPI1.CS1_N
NV_SPI1.MISO: U22.3(A2) ; port NV_SPI1.MISO
NV_SPI1.MOSI: U22.2(A1) ; port NV_SPI1.MOSI
NV_UART1.CTS: U18.4(A3) ; port NV_UART1.CTS
NV_UART1.RTS: U18.2(A1) ; port NV_UART1.RTS
NV_UART1.RX: U18.5(A4) ; port NV_UART1.RX
NV_UART1.TX: U18.3(A2) ; port NV_UART1.TX
NetC252_2: C252.2 U17.4(Ct)
NetJ9_16: J9.16 ; port GPIO08_AO_DMIC_IN_DAT
NetP1_A53: R176.1 ; port NV_I2C5.CLK
NetP1_C53: R177.1 ; port NV_I2C5.DATA
NetR167_1: R167.1 U17.1(RESET) U18.8(EN)
NetR168_1: R168.1 U19.8(EN)
NetR169_1: R169.1 U20.8(EN)
NetR174_2: R174.2 U20.2(A1)
NetR175_2: R175.2 U20.3(A2)
NetR176_2: R176.2 U20.4(A3)
NetR177_2: R177.2 U20.5(A4)
NetR178_1: R178.1 U21.8(EN)
NetR179_1: R179.1 U22.8(EN)
NetR180_1: R180.1 U23.8(EN)
NetU21_3: U21.3(A2) ; port GPIO17
NetU23_3: U23.3(A2) ; port GPIO32_PWM1
NetU23_4: U23.4(A3) ; port GPIO27_PWM2
NetU23_5: U23.5(A4) ; port GPIO35_PWM3

Not connected (* = marked no-connect by the designer): J9 03* 05* 07* 08* 10* 11* 12* 13* 15* 18* 19* 21* 22* 23* 24* 26* 27* 28* 29* 31* 32* 33* 35* 36* 37* 38* 40*; U17 3(MR); U18 10(B4)* 11(B3)* 12(B2)* 13(B1)*; U19 10(B4)* 11(B3)* 12(B2)* 13(B1)*; U21 2(A1)* 4(A3)* 5(A4)* 10(B4)* 11(B3)* 12(B2)* 13(B1)*; U22 10(B4)* 11(B3)* 12(B2)* 13(B1)*; U23 10(B4)* 11(B3)* 12(B2)* 13(B1)*

### Notes on the sheet
- GPIO Expansion
- CAN disconnected since using onboard CAN transceivers
- (near C249) Level Shifters
- (near U17) 5s Delay Buffer
- For a 5s delay:
  Ct = (5 - 0.5E-3) * 175n = 875nF
  Can use 1000nF ie 1uF for a 5.7 s delay which is close enough
- Level shifter IC out of stock, may need to replace
- Issues:
  - I2C2 already used by M.2 E-key
  - I2C5 marked as DO NOT USE
- 1.8V - 3.3V Level Shifter
- University of Waterloo Robotics Team
- 200 University Ave W
- REV
- PROJECT
- Waterloo, Ontario, Canada
- N2L 3G1
- DOCUMENT
- ENGINEER
- REVIEWER
- MODIFIED
- SHEET
- OF

### Library data of the parts
C249 = CAP_0.1uF_16V_X7R_0402: CAP CER 0.1UF 16V X7R 0402; Supplier 1: Digi-Key; Mounting Type: Surface Mount; Package: 0402
C250 C251 C253-C262 = CAP_0.1uF_10V_0402: CAP CER 0.1UF 10V X7R 0402; Manufacturer Part Number 1: GRM155R71A104KA01D; Manufacturer 1: Murata Electronics; Package/Footprint: 0402; Supplier Part Number 1: 490-6321-1-ND; Supplier 1: Digi-Key
C252 = CAP_1uF_25V_0402: CAP CER 1UF 25V X5R 0402; Manufacturer 1: TDK Corporation; Manufacturer Part Number 1: C1005X5R1E105K050BE; Supplier 1: Digi-Key; Supplier Part Number 1: 445-175215-1-ND; Package: 0402
J9 = TSM-120-01-S-DV-P-TR: CONN HEADER SMD 40POS 2.54MM; Manufacturer 1: Samtec Inc.; Supplier 1: Digi-Key; Supplier Part Number 1: SAM14896CT-ND; Manufacturer Part Number 1: TSM-120-01-S-DV-P-TR
R167 = RES_10kΩ_0402_1%: as R132 on sheet M.2 E-KEY; Supplier 1: Digi-Key; Supplier Part Number 1: 1276-3431-1-ND; Tolerance: 1%; Package: 0402
R168 R169 R178-R180 = RES_10kΩ_0402_1%: as R144 on sheet M.2 M-KEY; Supplier 1: Digi-Key; Supplier Part Number 1: 541-2955-1-ND; Mounting Type: SMD; Tolerance: 1%
R170-R173 = RES_2.2kΩ_0402_5%: RES SMD 2.2K OHM 5% 1/10W 0402; Manufacturer 1: Panasonic Electronic Components; Manufacturer Part Number 1: ERJ-2GEJ222X; Package/Footprint: 0402; Supplier Part Number 1: P2.2KJCT-ND; Supplier 1: Digi-Key; Mounting Type: SMD
R174-R177 = RES_0Ω_0603: as R146 on sheet M.2 M-KEY; Supplier Part Number 1: 311-0.0GRCT-ND; Supplier 1: Digi-Key; Mounting Type: SMD
U17 = TPS3808G33MDBVREP: IC SUPERVISOR 1 CHANNEL SOT23-6; Manufacturer 1: Texas Instruments; Supplier 1: Digi-Key; Supplier Part Number 1: 296-23569-1-ND; Manufacturer Part Number 1: TPS3808G33MDBVREP
U18-U23 = LSF0204QPWRQ1: Automotive 4-Bit Bidirectional Multi-Voltage Level Translator for Open-Drain or Push- Pull Interface 14-TSSOP -40 to 125; Manufacturer 1: Texas Instruments; Channels per Circuit: 4; Output Type: Open Drain, Push Pull; Data Rate: 100MBd; Voltage - VCCA: 0.8V - 4.5V; Voltage - VCCB: 1.8V - 5.5V; Manufacturer Part Number 1: LSF0204QPWRQ1; Supplier 1: Digi-Key; Supplier Part Number 1: 296-51425-1-ND; Channel Type: Bidirectional; Package: 14-TSSOP

## Sheet CAN.SchDoc: CAN
size 279 x 215 mm; CheckedBy: Lance Bantoto; Engineer: Cindy Li; DocumentNumber: 21; Revision: 1; SheetNumber: 21; SheetTotal: 23
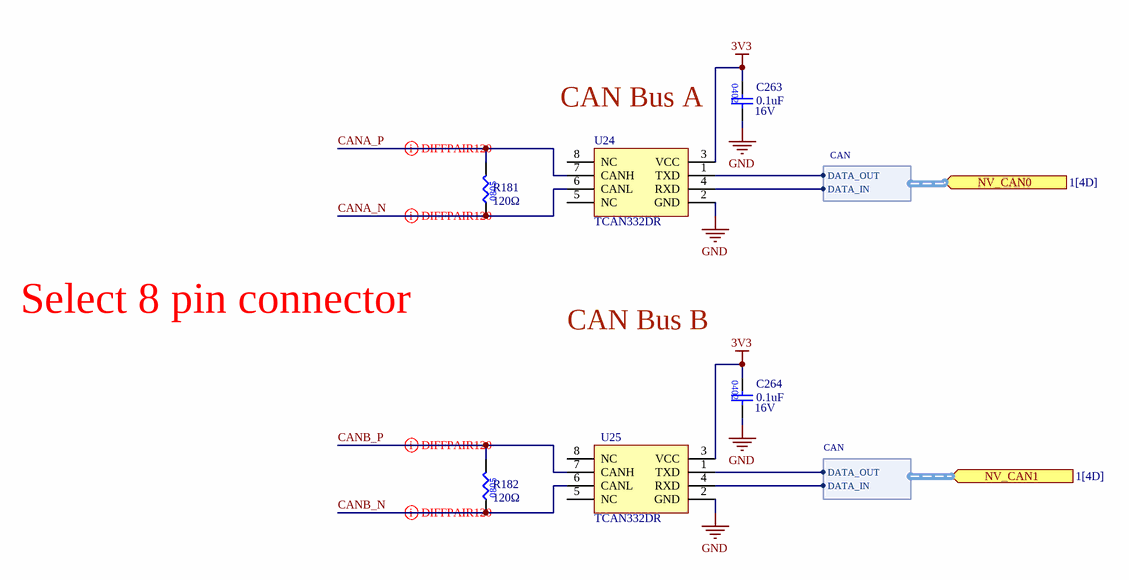
[diagram p9: CAN.SchDoc]

### Parts
C263  Capacitance: 0.1uF  Voltage Rating: 16V  [CAP0402]  (hidden comment: CAP_0.1uF_16V_X7R_0402)
C264  Capacitance: 0.1uF  Voltage Rating: 16V  [CAP0402]  (hidden comment: CAP_0.1uF_16V_X7R_0402)
R181  value 120Ω  [RES0805]  (hidden comment: RES_120Ω_0805_1%)
R182  value 120Ω  [RES0805]  (hidden comment: RES_120Ω_0805_1%)
U24  TCAN332DR  [SOIC127P599X175-8N]
U25  TCAN332DR  [SOIC127P599X175-8N]

### Ports
NV_CAN0 (in, harness CAN, see 1[4D]), NV_CAN1 (in, harness CAN, see 1[4D])

### Harnesses
CAN: DATA_OUT, DATA_IN

### Nets
3V3: C263.1 C264.1 U24.3(VCC) U25.3(VCC)
GND: C263.2 C264.2 U24.2(GND) U25.2(GND)
CANA_N: R181.1 U24.6(CANL)
CANA_P: R181.2 U24.7(CANH)
CANB_N: R182.1 U25.6(CANL)
CANB_P: R182.2 U25.7(CANH)
NV_CAN0.DATA_IN: U24.4(RXD) ; port NV_CAN0.DATA_IN
NV_CAN0.DATA_OUT: U24.1(TXD) ; port NV_CAN0.DATA_OUT
NV_CAN1.DATA_IN: U25.4(RXD) ; port NV_CAN1.DATA_IN
NV_CAN1.DATA_OUT: U25.1(TXD) ; port NV_CAN1.DATA_OUT

Not connected (* = marked no-connect by the designer): U24 5(NC) 8(NC); U25 5(NC) 8(NC)

### Layout directives
differential pair: CANA_N, CANA_P, CANB_N, CANB_P

### Notes on the sheet
- CAN Bus A
- Select 8 pin connector
- CAN Bus B
- University of Waterloo Robotics Team
- 200 University Ave W
- REV
- PROJECT
- Waterloo, Ontario, Canada
- N2L 3G1
- DOCUMENT
- ENGINEER
- REVIEWER
- MODIFIED
- SHEET
- OF

### Library data of the parts
C263 C264 = CAP_0.1uF_16V_X7R_0402: CAP CER 0.1UF 16V X7R 0402; Supplier 1: Digi-Key; Mounting Type: Surface Mount; Package: 0402
R181 R182 = RES_120Ω_0805_1%: RES 120 OHM 1% 1/8W 0805; Manufacturer 1: Vishay; Manufacturer Part Number 1: CRCW0805120RFKEA; Package/Footprint: 0805; Supplier Part Number 1: 541-120CCT-ND; Supplier 1: Digi-Key; LCSC Part #: C17437; Mounting Type: SMD
U24 U25 = TCAN332DR: IC CAN TRANSCEIVER; Manufacturer 1: Texas Instruments; Manufacturer Part Number 1: TCAN332DR; Supplier Part Number 1: 296-43711-1-ND; Supplier 1: Digi-Key

## Sheet JETSON AGX CONNECTOR.SchDoc: Jetson AGX Connector
size 431 x 279 mm; CheckedBy: Lance Bantoto; Engineer: Cindy Li, Chealsie Bains; DocumentNumber: 4; Revision: 1; SheetNumber: 4; SheetTotal: 23
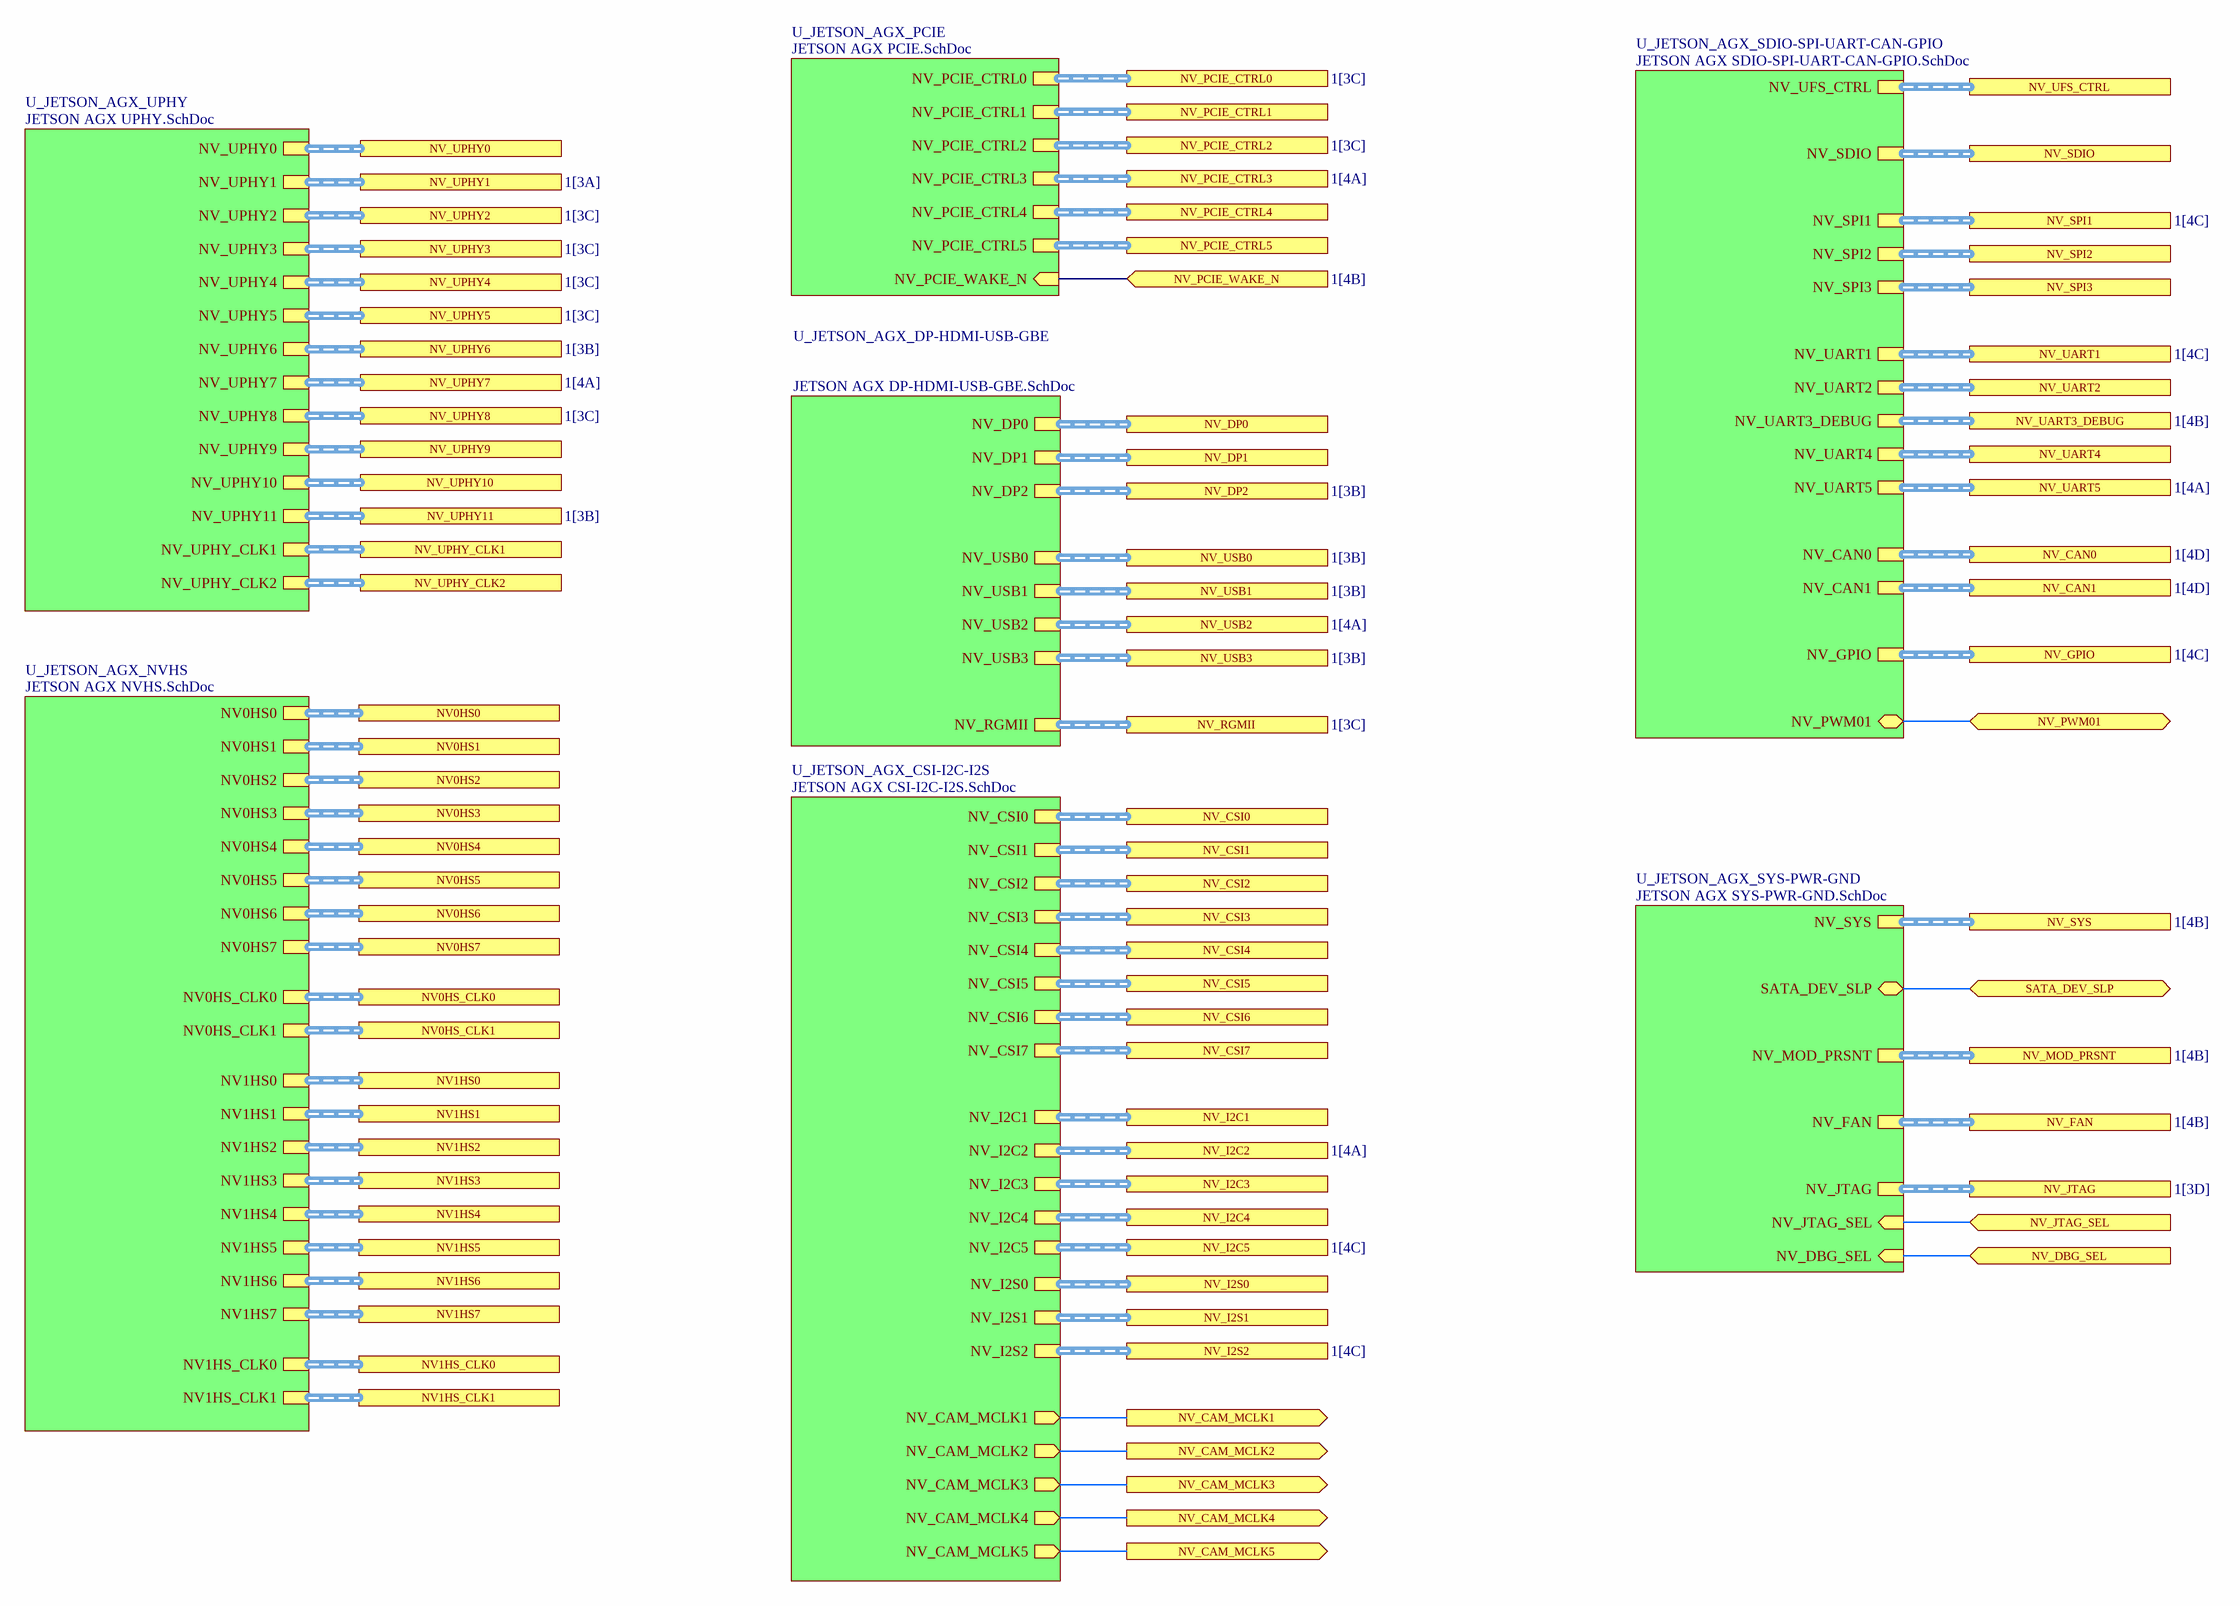
[diagram p10: JETSON AGX CONNECTOR.SchDoc]

### Sub-sheets
U_JETSON_AGX_CSI-I2C-I2S = JETSON AGX CSI-I2C-I2S.SchDoc: NV_CSI0 (harness CSI_X2), NV_CSI1 (harness CSI_X2), NV_CSI2 (harness CSI_X2), NV_CSI3 (harness CSI_X2), NV_CSI4 (harness CSI_X2), NV_CSI5 (harness CSI_X2), NV_CSI6 (harness CSI_X2), NV_CSI7 (harness CSI_X2), NV_I2C1 (harness I2C), NV_I2C2 (harness I2C), NV_I2C3 (harness I2C), NV_I2C4 (harness I2C), NV_I2S1 (harness I2S), NV_I2S0 (harness I2S), NV_I2S2 (harness I2S), NV_CAM_MCLK1 (out), NV_CAM_MCLK2 (out), NV_CAM_MCLK3 (out), NV_CAM_MCLK4 (out), NV_CAM_MCLK5 (out), NV_I2C5 (harness I2C)
U_JETSON_AGX_DP-HDMI-USB-GBE = JETSON AGX DP-HDMI-USB-GBE.SchDoc: NV_DP0 (harness DISPLAYPORT), NV_DP1 (harness DISPLAYPORT), NV_DP2 (harness DISPLAYPORT), NV_USB0 (harness USB2), NV_USB1 (harness USB2), NV_USB2 (harness USB2), NV_USB3 (harness USB2), NV_RGMII (harness RGMII)
U_JETSON_AGX_NVHS = JETSON AGX NVHS.SchDoc: NV0HS0 (harness NVHS), NV0HS1 (harness NVHS), NV0HS2 (harness NVHS), NV0HS3 (harness NVHS), NV0HS4 (harness NVHS), NV0HS5 (harness NVHS), NV0HS6 (harness NVHS), NV0HS7 (harness NVHS), NV0HS_CLK0 (harness NVHS_CLK), NV0HS_CLK1 (harness NVHS_CLK), NV1HS0 (harness NVHS), NV1HS_CLK0 (harness NVHS_CLK), NV1HS1 (harness NVHS), NV1HS2 (harness NVHS), NV1HS3 (harness NVHS), NV1HS4 (harness NVHS), NV1HS5 (harness NVHS), NV1HS6 (harness NVHS), NV1HS7 (harness NVHS), NV1HS_CLK1 (harness NVHS_CLK)
U_JETSON_AGX_PCIE = JETSON AGX PCIE.SchDoc: NV_PCIE_CTRL0 (harness PCIE_CTRL), NV_PCIE_CTRL1 (harness PCIE_CTRL), NV_PCIE_CTRL2 (harness PCIE_CTRL), NV_PCIE_CTRL3 (harness PCIE_CTRL), NV_PCIE_CTRL4 (harness PCIE_CTRL), NV_PCIE_CTRL5 (harness PCIE_CTRL), NV_PCIE_WAKE_N (in)
U_JETSON_AGX_SDIO-SPI-UART-CAN-GPIO = JETSON AGX SDIO-SPI-UART-CAN-GPIO.SchDoc: NV_SDIO (harness SDIO), NV_SPI1 (harness SPI), NV_SPI2 (harness SPI), NV_SPI3 (harness SPI), NV_UFS_CTRL (harness UFS_CTRL), NV_UART1 (harness UART_5-W), NV_UART3_DEBUG (harness UART_3-W), NV_UART2 (harness UART_5-W), NV_UART4 (harness UART_5-W), NV_UART5 (harness UART_5-W), NV_CAN0 (harness CAN), NV_CAN1 (harness CAN), NV_PWM01 (bidir), NV_GPIO (harness NV_GPIO)
U_JETSON_AGX_SYS-PWR-GND = JETSON AGX SYS-PWR-GND.SchDoc: NV_JTAG (harness NV_JTAG), NV_JTAG_SEL (in), NV_DBG_SEL (in), NV_FAN (harness FAN), NV_SYS (harness NV_SYS), SATA_DEV_SLP (bidir), NV_MOD_PRSNT (harness MOD_PRSNT)
U_JETSON_AGX_UPHY = JETSON AGX UPHY.SchDoc: NV_UPHY0 (harness UPHY), NV_UPHY1 (harness UPHY), NV_UPHY2 (harness UPHY), NV_UPHY3 (harness UPHY), NV_UPHY4 (harness UPHY), NV_UPHY5 (harness UPHY), NV_UPHY6 (harness UPHY), NV_UPHY7 (harness UPHY), NV_UPHY8 (harness UPHY), NV_UPHY9 (harness UPHY), NV_UPHY10 (harness UPHY), NV_UPHY11 (harness UPHY), NV_UPHY_CLK1 (harness UPHY_CLK), NV_UPHY_CLK2 (harness UPHY_CLK)

### Ports
NV0HS0 (harness NVHS), NV0HS1 (harness NVHS), NV0HS2 (harness NVHS), NV0HS3 (harness NVHS), NV0HS4 (harness NVHS), NV0HS5 (harness NVHS), NV0HS6 (harness NVHS), NV0HS7 (harness NVHS), NV0HS_CLK0 (harness NVHS_CLK), NV0HS_CLK1 (harness NVHS_CLK), NV1HS0 (harness NVHS), NV1HS1 (harness NVHS), NV1HS2 (harness NVHS), NV1HS3 (harness NVHS), NV1HS4 (harness NVHS), NV1HS5 (harness NVHS), NV1HS6 (harness NVHS), NV1HS7 (harness NVHS), NV1HS_CLK0 (harness NVHS_CLK), NV1HS_CLK1 (harness NVHS_CLK), NV_CAM_MCLK1 (out), NV_CAM_MCLK2 (out), NV_CAM_MCLK3 (out), NV_CAM_MCLK4 (out), NV_CAM_MCLK5 (out), NV_CAN0 (harness CAN, see 1[4D]), NV_CAN1 (harness CAN, see 1[4D]), NV_CSI0 (harness CSI_X2), NV_CSI1 (harness CSI_X2), NV_CSI2 (harness CSI_X2), NV_CSI3 (harness CSI_X2), NV_CSI4 (harness CSI_X2), NV_CSI5 (harness CSI_X2), NV_CSI6 (harness CSI_X2), NV_CSI7 (harness CSI_X2), NV_DBG_SEL (in), NV_DP0 (harness DISPLAYPORT), NV_DP1 (harness DISPLAYPORT), NV_DP2 (harness DISPLAYPORT, see 1[3B]), NV_FAN (harness FAN, see 1[4B]), NV_GPIO (harness NV_GPIO, see 1[4C]), NV_I2C1 (harness I2C), NV_I2C2 (harness I2C, see 1[4A]), NV_I2C3 (harness I2C), NV_I2C4 (harness I2C), NV_I2C5 (harness I2C, see 1[4C]), NV_I2S0 (harness I2S), NV_I2S1 (harness I2S), NV_I2S2 (harness I2S, see 1[4C]), NV_JTAG (harness NV_JTAG, see 1[3D]), NV_JTAG_SEL (in), NV_MOD_PRSNT (harness MOD_PRSNT, see 1[4B]), NV_PCIE_CTRL0 (harness PCIE_CTRL, see 1[3C]), NV_PCIE_CTRL1 (harness PCIE_CTRL), NV_PCIE_CTRL2 (harness PCIE_CTRL, see 1[3C]), NV_PCIE_CTRL3 (harness PCIE_CTRL, see 1[4A]), NV_PCIE_CTRL4 (harness PCIE_CTRL), NV_PCIE_CTRL5 (harness PCIE_CTRL), NV_PCIE_WAKE_N (in, see 1[4B]), NV_PWM01 (bidir), NV_RGMII (harness RGMII, see 1[3C]), NV_SDIO (harness SDIO), NV_SPI1 (harness SPI, see 1[4C]), NV_SPI2 (harness SPI), NV_SPI3 (harness SPI), NV_SYS (harness NV_SYS, see 1[4B]), NV_UART1 (harness UART_5-W, see 1[4C]), NV_UART2 (harness UART_5-W), NV_UART3_DEBUG (harness UART_3-W, see 1[4B]), NV_UART4 (harness UART_5-W), NV_UART5 (harness UART_5-W, see 1[4A]), NV_UFS_CTRL (harness UFS_CTRL), NV_UPHY0 (harness UPHY), NV_UPHY1 (harness UPHY, see 1[3A]), NV_UPHY2 (harness UPHY, see 1[3C]), NV_UPHY3 (harness UPHY, see 1[3C]), NV_UPHY4 (harness UPHY, see 1[3C]), NV_UPHY5 (harness UPHY, see 1[3C]), NV_UPHY6 (harness UPHY, see 1[3B]), NV_UPHY7 (harness UPHY, see 1[4A]), NV_UPHY8 (harness UPHY, see 1[3C]), NV_UPHY9 (harness UPHY), NV_UPHY10 (harness UPHY), NV_UPHY11 (harness UPHY, see 1[3B]), NV_UPHY_CLK1 (harness UPHY_CLK), NV_UPHY_CLK2 (harness UPHY_CLK), NV_USB0 (harness USB2, see 1[3B]), NV_USB1 (harness USB2, see 1[3B]), NV_USB2 (harness USB2, see 1[4A]), NV_USB3 (harness USB2, see 1[3B]), SATA_DEV_SLP (bidir)

### Nets
NV_CAM_MCLK1: port NV_CAM_MCLK1, sheet U_JETSON_AGX_CSI-I2C-I2S/NV_CAM_MCLK1
NV_CAM_MCLK2: port NV_CAM_MCLK2, sheet U_JETSON_AGX_CSI-I2C-I2S/NV_CAM_MCLK2
NV_CAM_MCLK3: port NV_CAM_MCLK3, sheet U_JETSON_AGX_CSI-I2C-I2S/NV_CAM_MCLK3
NV_CAM_MCLK4: port NV_CAM_MCLK4, sheet U_JETSON_AGX_CSI-I2C-I2S/NV_CAM_MCLK4
NV_CAM_MCLK5: port NV_CAM_MCLK5, sheet U_JETSON_AGX_CSI-I2C-I2S/NV_CAM_MCLK5
NV_DBG_SEL: port NV_DBG_SEL, sheet U_JETSON_AGX_SYS-PWR-GND/NV_DBG_SEL
NV_JTAG_SEL: port NV_JTAG_SEL, sheet U_JETSON_AGX_SYS-PWR-GND/NV_JTAG_SEL
NV_PCIE_WAKE_N: port NV_PCIE_WAKE_N, sheet U_JETSON_AGX_PCIE/NV_PCIE_WAKE_N
NV_PWM01: port NV_PWM01, sheet U_JETSON_AGX_SDIO-SPI-UART-CAN-GPIO/NV_PWM01
SATA_DEV_SLP: port SATA_DEV_SLP, sheet U_JETSON_AGX_SYS-PWR-GND/SATA_DEV_SLP

### Buses and harness runs
harness port NV0HS0 = sheet U_JETSON_AGX_NVHS/NV0HS0
harness port NV0HS1 = sheet U_JETSON_AGX_NVHS/NV0HS1
harness port NV0HS2 = sheet U_JETSON_AGX_NVHS/NV0HS2
harness port NV0HS3 = sheet U_JETSON_AGX_NVHS/NV0HS3
harness port NV0HS4 = sheet U_JETSON_AGX_NVHS/NV0HS4
harness port NV0HS5 = sheet U_JETSON_AGX_NVHS/NV0HS5
harness port NV0HS6 = sheet U_JETSON_AGX_NVHS/NV0HS6
harness port NV0HS7 = sheet U_JETSON_AGX_NVHS/NV0HS7
harness port NV0HS_CLK0 = sheet U_JETSON_AGX_NVHS/NV0HS_CLK0
harness port NV0HS_CLK1 = sheet U_JETSON_AGX_NVHS/NV0HS_CLK1
harness port NV1HS0 = sheet U_JETSON_AGX_NVHS/NV1HS0
harness port NV1HS1 = sheet U_JETSON_AGX_NVHS/NV1HS1
harness port NV1HS2 = sheet U_JETSON_AGX_NVHS/NV1HS2
harness port NV1HS3 = sheet U_JETSON_AGX_NVHS/NV1HS3
harness port NV1HS4 = sheet U_JETSON_AGX_NVHS/NV1HS4
harness port NV1HS5 = sheet U_JETSON_AGX_NVHS/NV1HS5
harness port NV1HS6 = sheet U_JETSON_AGX_NVHS/NV1HS6
harness port NV1HS7 = sheet U_JETSON_AGX_NVHS/NV1HS7
harness port NV1HS_CLK0 = sheet U_JETSON_AGX_NVHS/NV1HS_CLK0
harness port NV1HS_CLK1 = sheet U_JETSON_AGX_NVHS/NV1HS_CLK1
harness port NV_CAN0 = sheet U_JETSON_AGX_SDIO-SPI-UART-CAN-GPIO/NV_CAN0
harness port NV_CAN1 = sheet U_JETSON_AGX_SDIO-SPI-UART-CAN-GPIO/NV_CAN1
harness port NV_CSI0 = sheet U_JETSON_AGX_CSI-I2C-I2S/NV_CSI0
harness port NV_CSI1 = sheet U_JETSON_AGX_CSI-I2C-I2S/NV_CSI1
harness port NV_CSI2 = sheet U_JETSON_AGX_CSI-I2C-I2S/NV_CSI2
harness port NV_CSI3 = sheet U_JETSON_AGX_CSI-I2C-I2S/NV_CSI3
harness port NV_CSI4 = sheet U_JETSON_AGX_CSI-I2C-I2S/NV_CSI4
harness port NV_CSI5 = sheet U_JETSON_AGX_CSI-I2C-I2S/NV_CSI5
harness port NV_CSI6 = sheet U_JETSON_AGX_CSI-I2C-I2S/NV_CSI6
harness port NV_CSI7 = sheet U_JETSON_AGX_CSI-I2C-I2S/NV_CSI7
harness port NV_DP0 = sheet U_JETSON_AGX_DP-HDMI-USB-GBE/NV_DP0
harness port NV_DP1 = sheet U_JETSON_AGX_DP-HDMI-USB-GBE/NV_DP1
harness port NV_DP2 = sheet U_JETSON_AGX_DP-HDMI-USB-GBE/NV_DP2
harness port NV_FAN = sheet U_JETSON_AGX_SYS-PWR-GND/NV_FAN
harness port NV_GPIO = sheet U_JETSON_AGX_SDIO-SPI-UART-CAN-GPIO/NV_GPIO
harness port NV_I2C1 = sheet U_JETSON_AGX_CSI-I2C-I2S/NV_I2C1
harness port NV_I2C2 = sheet U_JETSON_AGX_CSI-I2C-I2S/NV_I2C2
harness port NV_I2C3 = sheet U_JETSON_AGX_CSI-I2C-I2S/NV_I2C3
harness port NV_I2C4 = sheet U_JETSON_AGX_CSI-I2C-I2S/NV_I2C4
harness port NV_I2C5 = sheet U_JETSON_AGX_CSI-I2C-I2S/NV_I2C5
harness port NV_I2S0 = sheet U_JETSON_AGX_CSI-I2C-I2S/NV_I2S0
harness port NV_I2S1 = sheet U_JETSON_AGX_CSI-I2C-I2S/NV_I2S1
harness port NV_I2S2 = sheet U_JETSON_AGX_CSI-I2C-I2S/NV_I2S2
harness port NV_JTAG = sheet U_JETSON_AGX_SYS-PWR-GND/NV_JTAG
harness port NV_MOD_PRSNT = sheet U_JETSON_AGX_SYS-PWR-GND/NV_MOD_PRSNT
harness port NV_PCIE_CTRL0 = sheet U_JETSON_AGX_PCIE/NV_PCIE_CTRL0
harness port NV_PCIE_CTRL1 = sheet U_JETSON_AGX_PCIE/NV_PCIE_CTRL1
harness port NV_PCIE_CTRL2 = sheet U_JETSON_AGX_PCIE/NV_PCIE_CTRL2
harness port NV_PCIE_CTRL3 = sheet U_JETSON_AGX_PCIE/NV_PCIE_CTRL3
harness port NV_PCIE_CTRL4 = sheet U_JETSON_AGX_PCIE/NV_PCIE_CTRL4
harness port NV_PCIE_CTRL5 = sheet U_JETSON_AGX_PCIE/NV_PCIE_CTRL5
harness port NV_RGMII = sheet U_JETSON_AGX_DP-HDMI-USB-GBE/NV_RGMII
harness port NV_SDIO = sheet U_JETSON_AGX_SDIO-SPI-UART-CAN-GPIO/NV_SDIO
harness port NV_SPI1 = sheet U_JETSON_AGX_SDIO-SPI-UART-CAN-GPIO/NV_SPI1
harness port NV_SPI2 = sheet U_JETSON_AGX_SDIO-SPI-UART-CAN-GPIO/NV_SPI2
harness port NV_SPI3 = sheet U_JETSON_AGX_SDIO-SPI-UART-CAN-GPIO/NV_SPI3
harness port NV_SYS = sheet U_JETSON_AGX_SYS-PWR-GND/NV_SYS
harness port NV_UART1 = sheet U_JETSON_AGX_SDIO-SPI-UART-CAN-GPIO/NV_UART1
harness port NV_UART2 = sheet U_JETSON_AGX_SDIO-SPI-UART-CAN-GPIO/NV_UART2
harness port NV_UART3_DEBUG = sheet U_JETSON_AGX_SDIO-SPI-UART-CAN-GPIO/NV_UART3_DEBUG
harness port NV_UART4 = sheet U_JETSON_AGX_SDIO-SPI-UART-CAN-GPIO/NV_UART4
harness port NV_UART5 = sheet U_JETSON_AGX_SDIO-SPI-UART-CAN-GPIO/NV_UART5
harness port NV_UFS_CTRL = sheet U_JETSON_AGX_SDIO-SPI-UART-CAN-GPIO/NV_UFS_CTRL
harness port NV_UPHY0 = sheet U_JETSON_AGX_UPHY/NV_UPHY0
harness port NV_UPHY1 = sheet U_JETSON_AGX_UPHY/NV_UPHY1
harness port NV_UPHY2 = sheet U_JETSON_AGX_UPHY/NV_UPHY2
harness port NV_UPHY3 = sheet U_JETSON_AGX_UPHY/NV_UPHY3
harness port NV_UPHY4 = sheet U_JETSON_AGX_UPHY/NV_UPHY4
harness port NV_UPHY5 = sheet U_JETSON_AGX_UPHY/NV_UPHY5
harness port NV_UPHY6 = sheet U_JETSON_AGX_UPHY/NV_UPHY6
harness port NV_UPHY7 = sheet U_JETSON_AGX_UPHY/NV_UPHY7
harness port NV_UPHY8 = sheet U_JETSON_AGX_UPHY/NV_UPHY8
harness port NV_UPHY9 = sheet U_JETSON_AGX_UPHY/NV_UPHY9
harness port NV_UPHY10 = sheet U_JETSON_AGX_UPHY/NV_UPHY10
harness port NV_UPHY11 = sheet U_JETSON_AGX_UPHY/NV_UPHY11
harness port NV_UPHY_CLK1 = sheet U_JETSON_AGX_UPHY/NV_UPHY_CLK1
harness port NV_UPHY_CLK2 = sheet U_JETSON_AGX_UPHY/NV_UPHY_CLK2
harness port NV_USB0 = sheet U_JETSON_AGX_DP-HDMI-USB-GBE/NV_USB0
harness port NV_USB1 = sheet U_JETSON_AGX_DP-HDMI-USB-GBE/NV_USB1
harness port NV_USB2 = sheet U_JETSON_AGX_DP-HDMI-USB-GBE/NV_USB2
harness port NV_USB3 = sheet U_JETSON_AGX_DP-HDMI-USB-GBE/NV_USB3

### Notes on the sheet
- University of Waterloo Robotics Team
- 200 University Ave W
- REV
- PROJECT
- Waterloo, Ontario, Canada
- N2L 3G1
- DOCUMENT
- ENGINEER
- REVIEWER
- MODIFIED
- SHEET
- OF

## Sheet JETSON AGX CSI-I2C-I2S.SchDoc: Jetson AGX CSI-I2C-I2S
size 431 x 279 mm; CheckedBy: Lance Bantoto; Engineer: Cindy Li, Chealsie Bains; DocumentNumber: 8; Revision: 1; SheetNumber: 8; SheetTotal: 23
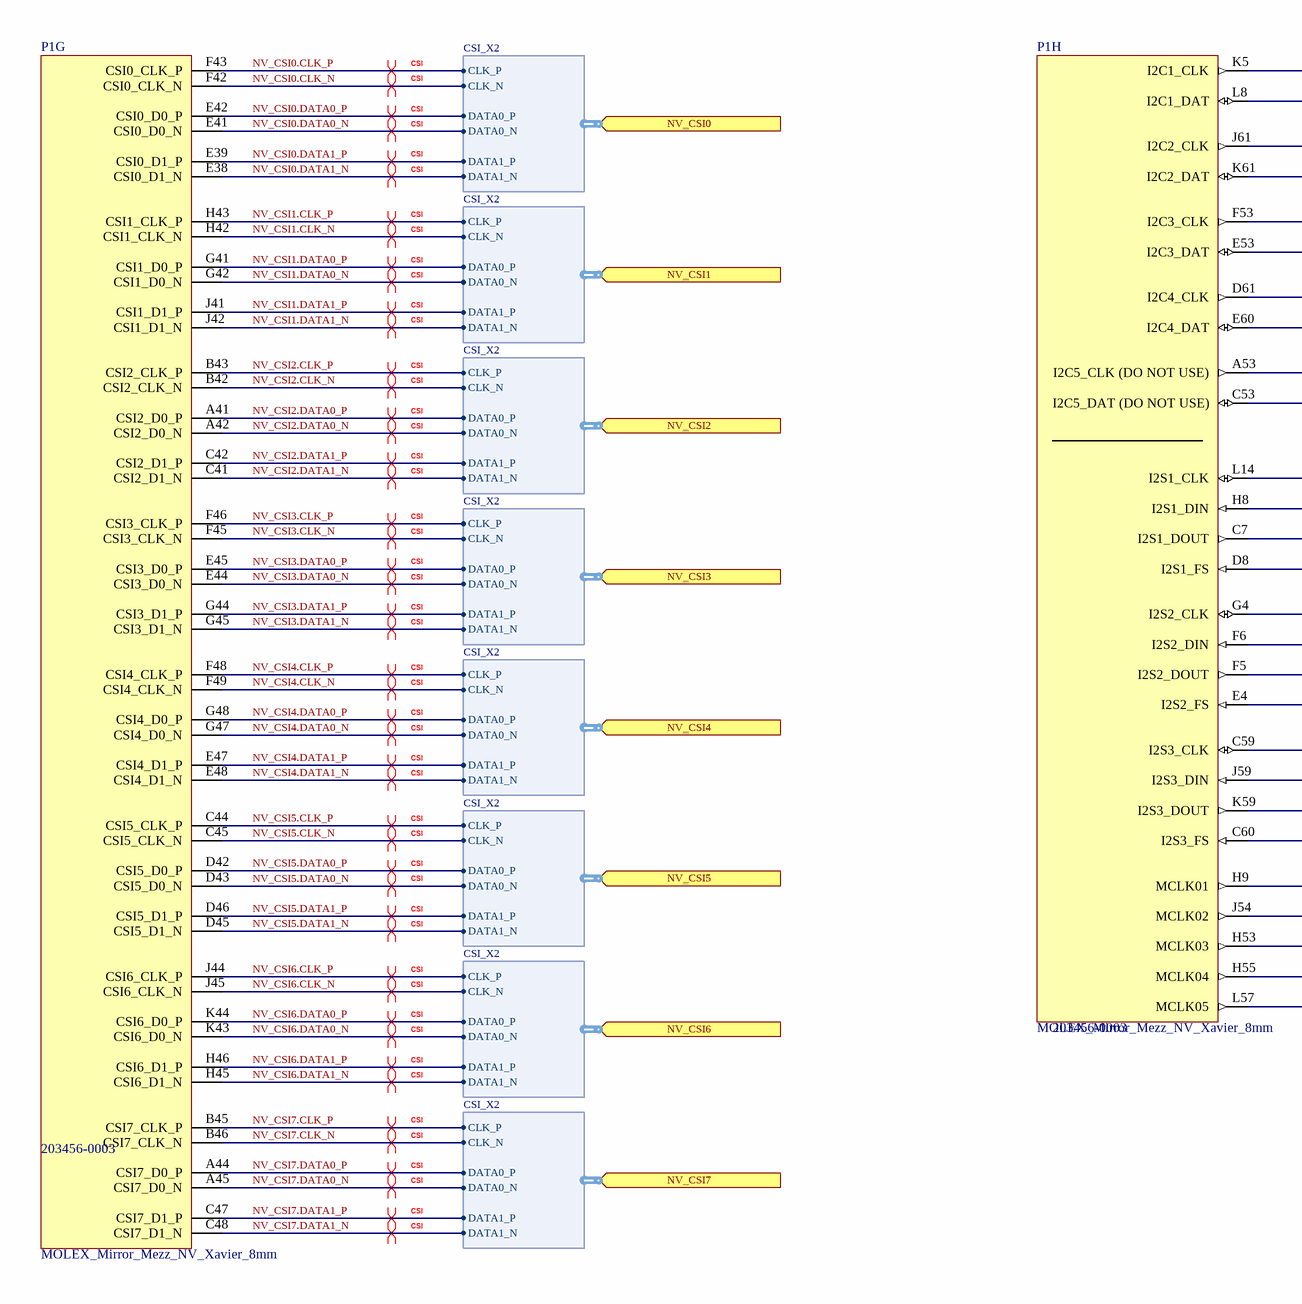
[diagram p11: JETSON AGX CSI-I2C-I2S.SchDoc, left]
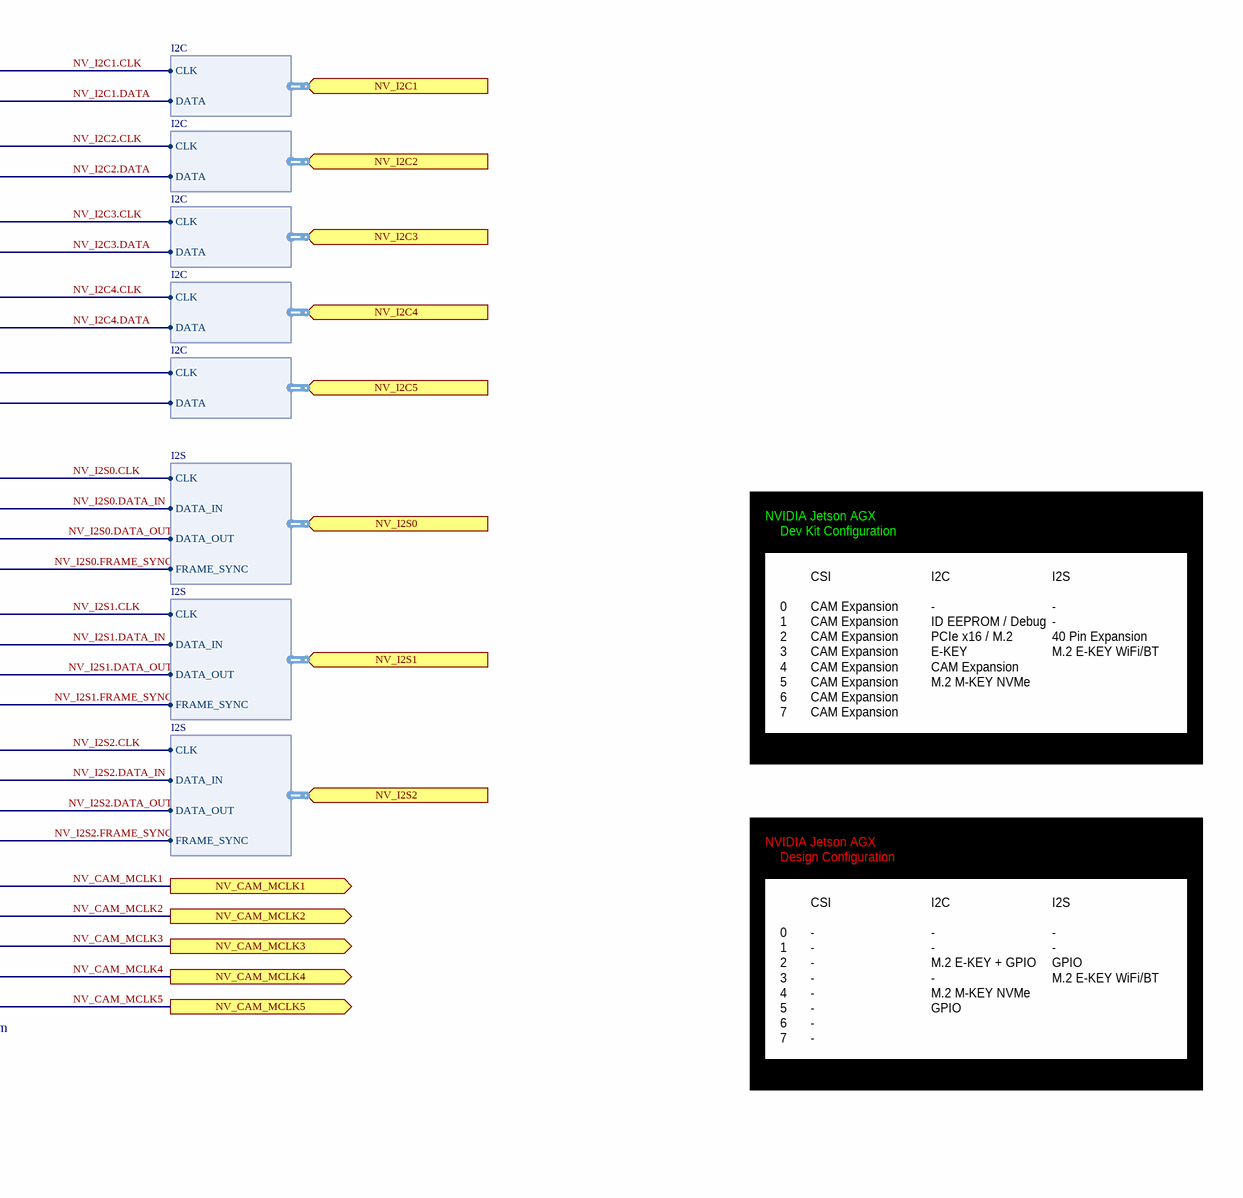
[diagram p12: JETSON AGX CSI-I2C-I2S.SchDoc, right]

### Parts
P1  MOLEX_Mirror_Mezz_NV_Xavier_8mm  [203456-0003]  (parts G,H of 15)

### Ports
NV_CAM_MCLK1 (out), NV_CAM_MCLK2 (out), NV_CAM_MCLK3 (out), NV_CAM_MCLK4 (out), NV_CAM_MCLK5 (out), NV_CSI0 (in, harness CSI_X2), NV_CSI1 (in, harness CSI_X2), NV_CSI2 (in, harness CSI_X2), NV_CSI3 (in, harness CSI_X2), NV_CSI4 (in, harness CSI_X2), NV_CSI5 (in, harness CSI_X2), NV_CSI6 (in, harness CSI_X2), NV_CSI7 (in, harness CSI_X2), NV_I2C1 (in, harness I2C), NV_I2C2 (in, harness I2C), NV_I2C3 (in, harness I2C), NV_I2C4 (in, harness I2C), NV_I2C5 (in, harness I2C), NV_I2S0 (in, harness I2S), NV_I2S1 (in, harness I2S), NV_I2S2 (in, harness I2S)

### Harnesses
CSI_X2: CLK_P, CLK_N, DATA0_P, DATA0_N, DATA1_P, DATA1_N
I2C: CLK, DATA
I2S: CLK, DATA_IN, DATA_OUT, FRAME_SYNC

### Nets
NV_CAM_MCLK1: P1.H9(MCLK01) ; port NV_CAM_MCLK1
NV_CAM_MCLK2: P1.J54(MCLK02) ; port NV_CAM_MCLK2
NV_CAM_MCLK3: P1.H53(MCLK03) ; port NV_CAM_MCLK3
NV_CAM_MCLK4: P1.H55(MCLK04) ; port NV_CAM_MCLK4
NV_CAM_MCLK5: P1.L57(MCLK05) ; port NV_CAM_MCLK5
NV_CSI0.CLK_N: P1.F42(CSI0_CLK_N) ; port NV_CSI0.CLK_N
NV_CSI0.CLK_P: P1.F43(CSI0_CLK_P) ; port NV_CSI0.CLK_P
NV_CSI0.DATA0_N: P1.E41(CSI0_D0_N) ; port NV_CSI0.DATA0_N
NV_CSI0.DATA0_P: P1.E42(CSI0_D0_P) ; port NV_CSI0.DATA0_P
NV_CSI0.DATA1_N: P1.E38(CSI0_D1_N) ; port NV_CSI0.DATA1_N
NV_CSI0.DATA1_P: P1.E39(CSI0_D1_P) ; port NV_CSI0.DATA1_P
NV_CSI1.CLK_N: P1.H42(CSI1_CLK_N) ; port NV_CSI1.CLK_N
NV_CSI1.CLK_P: P1.H43(CSI1_CLK_P) ; port NV_CSI1.CLK_P
NV_CSI1.DATA0_N: P1.G42(CSI1_D0_N) ; port NV_CSI1.DATA0_N
NV_CSI1.DATA0_P: P1.G41(CSI1_D0_P) ; port NV_CSI1.DATA0_P
NV_CSI1.DATA1_N: P1.J42(CSI1_D1_N) ; port NV_CSI1.DATA1_N
NV_CSI1.DATA1_P: P1.J41(CSI1_D1_P) ; port NV_CSI1.DATA1_P
NV_CSI2.CLK_N: P1.B42(CSI2_CLK_N) ; port NV_CSI2.CLK_N
NV_CSI2.CLK_P: P1.B43(CSI2_CLK_P) ; port NV_CSI2.CLK_P
NV_CSI2.DATA0_N: P1.A42(CSI2_D0_N) ; port NV_CSI2.DATA0_N
NV_CSI2.DATA0_P: P1.A41(CSI2_D0_P) ; port NV_CSI2.DATA0_P
NV_CSI2.DATA1_N: P1.C41(CSI2_D1_N) ; port NV_CSI2.DATA1_N
NV_CSI2.DATA1_P: P1.C42(CSI2_D1_P) ; port NV_CSI2.DATA1_P
NV_CSI3.CLK_N: P1.F45(CSI3_CLK_N) ; port NV_CSI3.CLK_N
NV_CSI3.CLK_P: P1.F46(CSI3_CLK_P) ; port NV_CSI3.CLK_P
NV_CSI3.DATA0_N: P1.E44(CSI3_D0_N) ; port NV_CSI3.DATA0_N
NV_CSI3.DATA0_P: P1.E45(CSI3_D0_P) ; port NV_CSI3.DATA0_P
NV_CSI3.DATA1_N: P1.G45(CSI3_D1_N) ; port NV_CSI3.DATA1_N
NV_CSI3.DATA1_P: P1.G44(CSI3_D1_P) ; port NV_CSI3.DATA1_P
NV_CSI4.CLK_N: P1.F49(CSI4_CLK_N) ; port NV_CSI4.CLK_N
NV_CSI4.CLK_P: P1.F48(CSI4_CLK_P) ; port NV_CSI4.CLK_P
NV_CSI4.DATA0_N: P1.G47(CSI4_D0_N) ; port NV_CSI4.DATA0_N
NV_CSI4.DATA0_P: P1.G48(CSI4_D0_P) ; port NV_CSI4.DATA0_P
NV_CSI4.DATA1_N: P1.E48(CSI4_D1_N) ; port NV_CSI4.DATA1_N
NV_CSI4.DATA1_P: P1.E47(CSI4_D1_P) ; port NV_CSI4.DATA1_P
NV_CSI5.CLK_N: P1.C45(CSI5_CLK_N) ; port NV_CSI5.CLK_N
NV_CSI5.CLK_P: P1.C44(CSI5_CLK_P) ; port NV_CSI5.CLK_P
NV_CSI5.DATA0_N: P1.D43(CSI5_D0_N) ; port NV_CSI5.DATA0_N
NV_CSI5.DATA0_P: P1.D42(CSI5_D0_P) ; port NV_CSI5.DATA0_P
NV_CSI5.DATA1_N: P1.D45(CSI5_D1_N) ; port NV_CSI5.DATA1_N
NV_CSI5.DATA1_P: P1.D46(CSI5_D1_P) ; port NV_CSI5.DATA1_P
NV_CSI6.CLK_N: P1.J45(CSI6_CLK_N) ; port NV_CSI6.CLK_N
NV_CSI6.CLK_P: P1.J44(CSI6_CLK_P) ; port NV_CSI6.CLK_P
NV_CSI6.DATA0_N: P1.K43(CSI6_D0_N) ; port NV_CSI6.DATA0_N
NV_CSI6.DATA0_P: P1.K44(CSI6_D0_P) ; port NV_CSI6.DATA0_P
NV_CSI6.DATA1_N: P1.H45(CSI6_D1_N) ; port NV_CSI6.DATA1_N
NV_CSI6.DATA1_P: P1.H46(CSI6_D1_P) ; port NV_CSI6.DATA1_P
NV_CSI7.CLK_N: P1.B46(CSI7_CLK_N) ; port NV_CSI7.CLK_N
NV_CSI7.CLK_P: P1.B45(CSI7_CLK_P) ; port NV_CSI7.CLK_P
NV_CSI7.DATA0_N: P1.A45(CSI7_D0_N) ; port NV_CSI7.DATA0_N
NV_CSI7.DATA0_P: P1.A44(CSI7_D0_P) ; port NV_CSI7.DATA0_P
NV_CSI7.DATA1_N: P1.C48(CSI7_D1_N) ; port NV_CSI7.DATA1_N
NV_CSI7.DATA1_P: P1.C47(CSI7_D1_P) ; port NV_CSI7.DATA1_P
NV_I2C1.CLK: P1.K5(I2C1_CLK) ; port NV_I2C1.CLK
NV_I2C1.DATA: P1.L8(I2C1_DAT) ; port NV_I2C1.DATA
NV_I2C2.CLK: P1.J61(I2C2_CLK) ; port NV_I2C2.CLK
NV_I2C2.DATA: P1.K61(I2C2_DAT) ; port NV_I2C2.DATA
NV_I2C3.CLK: P1.F53(I2C3_CLK) ; port NV_I2C3.CLK
NV_I2C3.DATA: P1.E53(I2C3_DAT) ; port NV_I2C3.DATA
NV_I2C4.CLK: P1.D61(I2C4_CLK) ; port NV_I2C4.CLK
NV_I2C4.DATA: P1.E60(I2C4_DAT) ; port NV_I2C4.DATA
NV_I2S0.CLK: P1.L14(I2S1_CLK) ; port NV_I2S0.CLK
NV_I2S0.DATA_IN: P1.H8(I2S1_DIN) ; port NV_I2S0.DATA_IN
NV_I2S0.DATA_OUT: P1.C7(I2S1_DOUT) ; port NV_I2S0.DATA_OUT
NV_I2S0.FRAME_SYNC: P1.D8(I2S1_FS) ; port NV_I2S0.FRAME_SYNC
NV_I2S1.CLK: P1.G4(I2S2_CLK) ; port NV_I2S1.CLK
NV_I2S1.DATA_IN: P1.F6(I2S2_DIN) ; port NV_I2S1.DATA_IN
NV_I2S1.DATA_OUT: P1.F5(I2S2_DOUT) ; port NV_I2S1.DATA_OUT
NV_I2S1.FRAME_SYNC: P1.E4(I2S2_FS) ; port NV_I2S1.FRAME_SYNC
NV_I2S2.CLK: P1.C59(I2S3_CLK) ; port NV_I2S2.CLK
NV_I2S2.DATA_IN: P1.J59(I2S3_DIN) ; port NV_I2S2.DATA_IN
NV_I2S2.DATA_OUT: P1.K59(I2S3_DOUT) ; port NV_I2S2.DATA_OUT
NV_I2S2.FRAME_SYNC: P1.C60(I2S3_FS) ; port NV_I2S2.FRAME_SYNC
NetP1_A53: P1.A53(I2C5_CLK_(DO_NOT_USE)) ; port NV_I2C5.CLK
NetP1_C53: P1.C53(I2C5_DAT_(DO_NOT_USE)) ; port NV_I2C5.DATA

### Layout directives
differential pair; differential pair class NV_CSI; differential pair class NV_CSI0; differential pair class CSI: NV_CSI0.CLK_N, NV_CSI0.CLK_P, NV_CSI0.DATA0_N, NV_CSI0.DATA0_P, NV_CSI0.DATA1_N, NV_CSI0.DATA1_P
differential pair; differential pair class NV_CSI; differential pair class NV_CSI1; differential pair class CSI: NV_CSI1.CLK_N, NV_CSI1.CLK_P, NV_CSI1.DATA0_N, NV_CSI1.DATA0_P, NV_CSI1.DATA1_N, NV_CSI1.DATA1_P
differential pair; differential pair class NV_CSI; differential pair class NV_CSI2; differential pair class CSI: NV_CSI2.CLK_N, NV_CSI2.CLK_P, NV_CSI2.DATA0_N, NV_CSI2.DATA0_P, NV_CSI2.DATA1_N, NV_CSI2.DATA1_P
differential pair; differential pair class NV_CSI; differential pair class NV_CSI3; differential pair class CSI: NV_CSI3.CLK_N, NV_CSI3.CLK_P, NV_CSI3.DATA0_N, NV_CSI3.DATA0_P, NV_CSI3.DATA1_N, NV_CSI3.DATA1_P
differential pair; differential pair class NV_CSI; differential pair class NV_CSI4; differential pair class CSI: NV_CSI4.CLK_N, NV_CSI4.CLK_P, NV_CSI4.DATA0_N, NV_CSI4.DATA0_P, NV_CSI4.DATA1_N, NV_CSI4.DATA1_P
differential pair; differential pair class NV_CSI; differential pair class NV_CSI5; differential pair class CSI: NV_CSI5.CLK_N, NV_CSI5.CLK_P, NV_CSI5.DATA0_N, NV_CSI5.DATA0_P, NV_CSI5.DATA1_N, NV_CSI5.DATA1_P
differential pair; differential pair class NV_CSI; differential pair class NV_CSI6; differential pair class CSI: NV_CSI6.CLK_N, NV_CSI6.CLK_P, NV_CSI6.DATA0_N, NV_CSI6.DATA0_P, NV_CSI6.DATA1_N, NV_CSI6.DATA1_P
differential pair; differential pair class NV_CSI; differential pair class NV_CSI7; differential pair class CSI: NV_CSI7.CLK_N, NV_CSI7.CLK_P, NV_CSI7.DATA0_N, NV_CSI7.DATA0_P, NV_CSI7.DATA1_N, NV_CSI7.DATA1_P

### Notes on the sheet
- NVIDIA Jetson AGX
- Dev Kit Configuration
- CSI
- I2C
- I2S
- -
  ID EEPROM / Debug
  PCIe x16 / M.2 E-KEY
  CAM Expansion
  M.2 M-KEY NVMe
  40 Pin Expansion
- -
  -
  40 Pin Expansion
  M.2 E-KEY WiFi/BT
- 0
  1
  2
  3
  4
  5
  6
  7
  8
  9
  10
  11
- CAM Expansion
  CAM Expansion
  CAM Expansion
  CAM Expansion
  CAM Expansion
  CAM Expansion
  CAM Expansion
  CAM Expansion
- Design Configuration
- -
  -
  GPIO
  M.2 E-KEY WiFi/BT
- -
  -
  -
  -
  -
  -
  -
  -
- -
  -
  M.2 E-KEY + GPIO
  -
  M.2 M-KEY NVMe
  GPIO
- University of Waterloo Robotics Team
- 200 University Ave W
- REV
- PROJECT
- Waterloo, Ontario, Canada
- N2L 3G1
- DOCUMENT
- ENGINEER
- REVIEWER
- MODIFIED
- SHEET
- OF

### Library data of the parts
P1 = MOLEX_Mirror_Mezz_NV_Xavier_8mm: CONN SELF-MATE 699POS SMD GOLD; Manufacturer 1: Molex; Supplier 1: Digi-Key; Supplier Part Number 1: WM25528CT-ND; Manufacturer Part Number 1: 203456-0003